# Altium project Traffic_Lignt_CU.PrjPCB
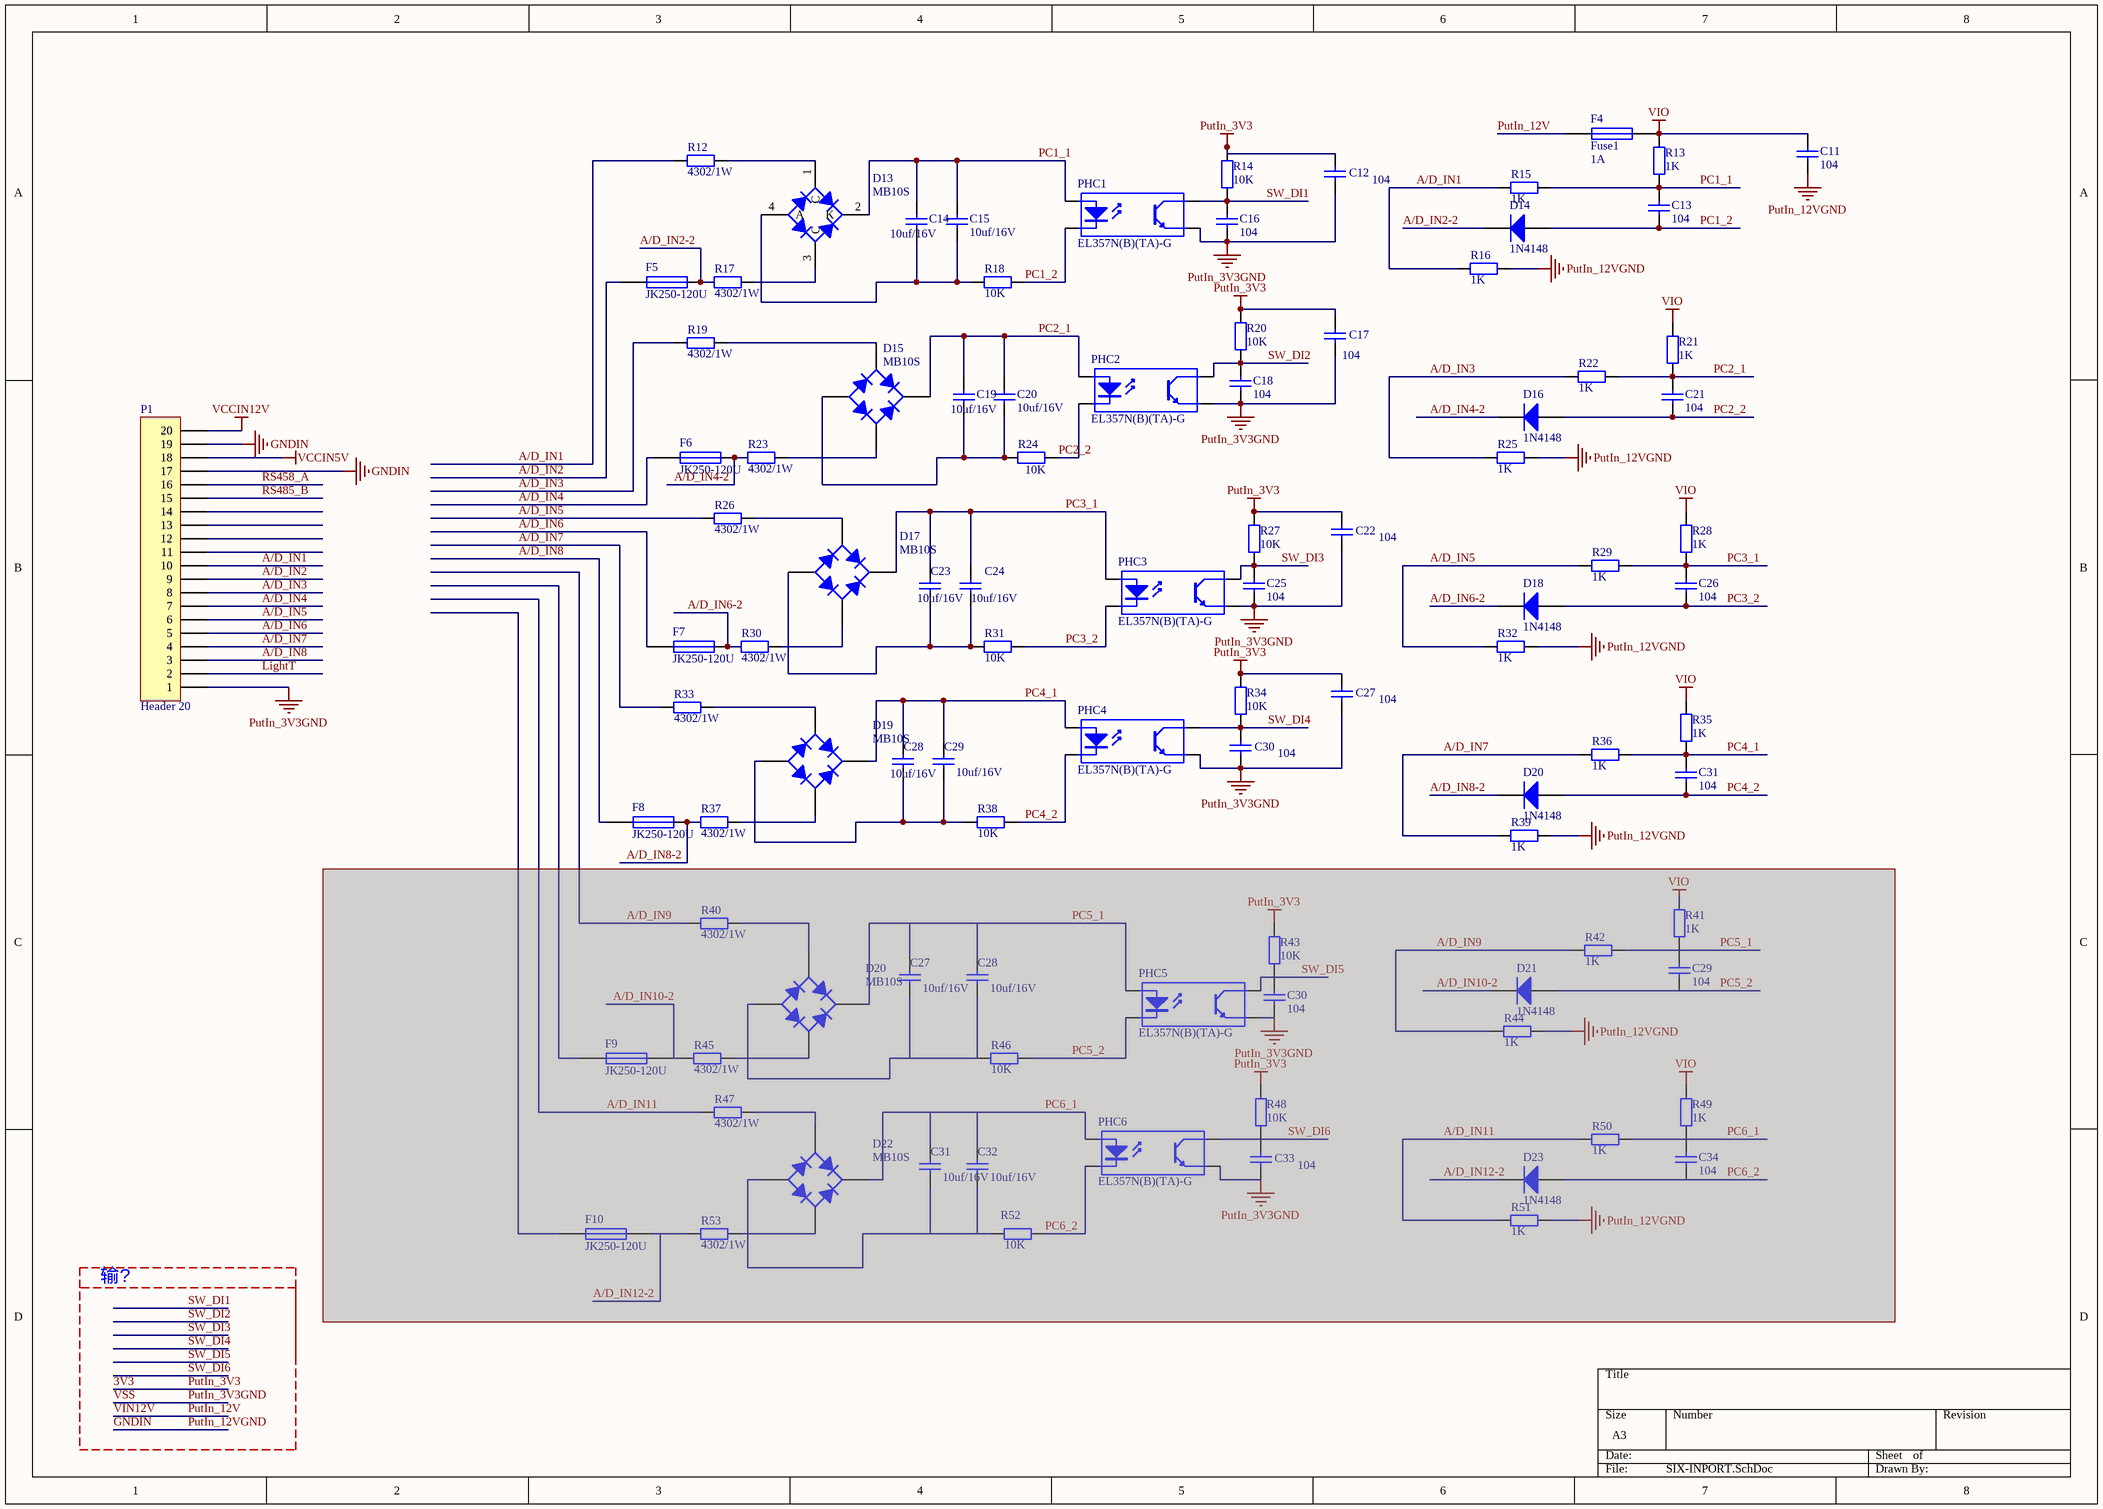
[diagram p0: SIX-INPORT.SchDoc]
5 sheets, 404 parts. Net scope: global (net labels, ports and power ports of the same name join across sheets).
Board file: PCB_LU_V2.4PcbDoc.PcbDoc
Sheets:
  SIX-INPORT.SchDoc
  RS485.SchDoc
  SIX_OUTPORT-V2.SchDoc
  POWER.SchDoc
  STM32F103最小系统板.SchDoc

## Sheet SIX-INPORT.SchDoc
size A3

### Parts
(Parts that share a designator on the sheet are numbered #1, #2 ... from top to bottom, then left to right.)
C11  104  [LC-0805_C]
C12  104  [LC-0603_C]
C13  104  [LC-0805_C]
C14#1  10uf/16V  [LC-0805_C]
C15#1  10uf/16V  [LC-0805_C]
C16  104  [LC-0603_C]
C17  104  [LC-0603_C]
C18#1  104  [LC-0603_C]
C19#1  10uf/16V  [LC-0805_C]
C20  10uf/16V  [LC-0805_C]
C21  104  [LC-0805_C]
C22  104  [LC-0603_C]
C23#1  10uf/16V  [LC-0805_C]
C24  10uf/16V  [LC-0805_C]
C25  104  [LC-0603_C]
C26  104  [LC-0805_C]
C27#1  104  [LC-0603_C]
C27#2  10uf/16V  [LC-0805_C]  (masked out: inside a compile mask, not in the netlist)
C28#1  10uf/16V  [LC-0805_C]
C28#2  10uf/16V  [LC-0805_C]  (masked out: inside a compile mask, not in the netlist)
C29#1  10uf/16V  [LC-0805_C]
C29#2  104  [LC-0805_C]  (masked out: inside a compile mask, not in the netlist)
C30#1  104  [LC-0603_C]
C30#2  104  [LC-0603_C]  (masked out: inside a compile mask, not in the netlist)
C31#1  104  [LC-0805_C]
C31#2  10uf/16V  [LC-0805_C]  (masked out: inside a compile mask, not in the netlist)
C32#1  10uf/16V  [LC-0805_C]  (masked out: inside a compile mask, not in the netlist)
C33#1  104  [LC-0603_C]  (masked out: inside a compile mask, not in the netlist)
C34#1  104  [LC-0805_C]  (masked out: inside a compile mask, not in the netlist)
D13  MB10S  [LC-MBS]
D14  1N4148  [LC-SOD-123]
D15  MB10S  [LC-MBS]
D16#1  1N4148  [LC-SOD-123]
D17  MB10S  [LC-MBS]
D18  1N4148  [LC-SOD-123]
D19  MB10S  [LC-MBS]
D20#1  1N4148  [LC-SOD-123]
D20#2  MB10S  [LC-MBS]  (masked out: inside a compile mask, not in the netlist)
D21#1  1N4148  [LC-SOD-123]  (masked out: inside a compile mask, not in the netlist)
D22#1  MB10S  [LC-MBS]  (masked out: inside a compile mask, not in the netlist)
D23#1  1N4148  [LC-SOD-123]  (masked out: inside a compile mask, not in the netlist)
F4  Fuse1  value 1A  [0805-1]
F5  JK250-120U  [ntc250v]
F6  JK250-120U  [ntc250v]
F7  JK250-120U  [ntc250v]
F8  JK250-120U  [ntc250v]
F9#1  JK250-120U  [ntc250v]  (masked out: inside a compile mask, not in the netlist)
F10  JK250-120U  [ntc250v]  (masked out: inside a compile mask, not in the netlist)
P1  Header 20  [HDR_5.0_20P]
PHC1  EL357N(B)(TA)-G  [LC-SOP-4_P2.54]
PHC2  EL357N(B)(TA)-G  [LC-SOP-4_P2.54]
PHC3  EL357N(B)(TA)-G  [LC-SOP-4_P2.54]
PHC4  EL357N(B)(TA)-G  [LC-SOP-4_P2.54]
PHC5  EL357N(B)(TA)-G  [LC-SOP-4_P2.54]  (masked out: inside a compile mask, not in the netlist)
PHC6  EL357N(B)(TA)-G  [LC-SOP-4_P2.54]  (masked out: inside a compile mask, not in the netlist)
R12  4302/1W  [1812]
R13  value 1K  [0805-1]  (hidden comment: Res1)
R14  10K  [LC-0603_R]
R15#1  value 1K  [0805-1]  (hidden comment: Res1)
R16#1  value 1K  [0805-1]  (hidden comment: Res1)
R17#1  4302/1W  [1812]
R18#1  10K  [LC-0603_R]
R19  4302/1W  [1812]
R20  10K  [LC-0603_R]
R21  value 1K  [0805-1]  (hidden comment: Res1)
R22  value 1K  [0805-1]  (hidden comment: Res1)
R23  4302/1W  [1812]
R24  10K  [LC-0603_R]
R25  value 1K  [0805-1]  (hidden comment: Res1)
R26  4302/1W  [1812]
R27  10K  [LC-0603_R]
R28#1  value 1K  [0805-1]  (hidden comment: Res1)
R29  value 1K  [0805-1]  (hidden comment: Res1)
R30  4302/1W  [1812]
R31  10K  [LC-0603_R]
R32  value 1K  [0805-1]  (hidden comment: Res1)
R33  4302/1W  [1812]
R34  10K  [LC-0603_R]
R35  value 1K  [0805-1]  (hidden comment: Res1)
R36  value 1K  [0805-1]  (hidden comment: Res1)
R37  4302/1W  [1812]
R38  10K  [LC-0603_R]
R39  value 1K  [0805-1]  (hidden comment: Res1)
R40#1  4302/1W  [1812]  (masked out: inside a compile mask, not in the netlist)
R41#1  value 1K  [0805-1]  (hidden comment: Res1)  (masked out: inside a compile mask, not in the netlist)
R42#1  value 1K  [0805-1]  (hidden comment: Res1)  (masked out: inside a compile mask, not in the netlist)
R43#1  10K  [LC-0603_R]  (masked out: inside a compile mask, not in the netlist)
R44#1  value 1K  [0805-1]  (hidden comment: Res1)  (masked out: inside a compile mask, not in the netlist)
R45#1  4302/1W  [1812]  (masked out: inside a compile mask, not in the netlist)
R46#1  10K  [LC-0603_R]  (masked out: inside a compile mask, not in the netlist)
R47#1  4302/1W  [1812]  (masked out: inside a compile mask, not in the netlist)
R48#1  10K  [LC-0603_R]  (masked out: inside a compile mask, not in the netlist)
R49#1  value 1K  [0805-1]  (hidden comment: Res1)  (masked out: inside a compile mask, not in the netlist)
R50#1  value 1K  [0805-1]  (hidden comment: Res1)  (masked out: inside a compile mask, not in the netlist)
R51#1  value 1K  [0805-1]  (hidden comment: Res1)  (masked out: inside a compile mask, not in the netlist)
R52#1  10K  [LC-0603_R]  (masked out: inside a compile mask, not in the netlist)
R53#1  4302/1W  [1812]  (masked out: inside a compile mask, not in the netlist)

### Nets
3V3: C12.1 C17.1 C22.1 C27#1.1 R14.2 R20.2 R27.2 R34.2  [also labelled PutIn_3V3]
GNDIN: C11.1 C12.2 C16.2 C17.2 C18#1.2 C22.2 C25.2 C27#1.2 C30#1.2 P1.1 P1.17 P1.19 PHC1.3(E) PHC2.3(E) PHC3.3(E) PHC4.3(E) R16#1.1 R25.1 R32.1 R39.1  [also labelled PutIn_12VGND, PutIn_3V3GND, VSS]
PutIn_12V: F4.1  [also labelled VIN12V]
VCCIN5V: P1.18
VCCIN12V: P1.20
VIO: C11.2 F4.2 R13.2 R21.1 R28#1.1 R35.1
A/D_IN1: P1.10 R12.1 R15#1.2 R16#1.2
A/D_IN2: F5.1 P1.9
A/D_IN2-2: D14.2(K) F5.2 R17#1.1
A/D_IN3: P1.8 R19.1 R22.2 R25.2
A/D_IN4: F6.1 P1.7
A/D_IN4-2: D16#1.2(K) F6.2 R23.1
A/D_IN5: P1.6 R26.1 R29.2 R32.2
A/D_IN6: F7.1 P1.5
A/D_IN6-2: D18.2(K) F7.2 R30.1
A/D_IN7: P1.4 R33.1 R36.2 R39.2
A/D_IN8: F8.1 P1.3
A/D_IN8-2: D20#1.2(K) F8.2 R37.1
LightT: P1.2
PC1_1: C13.1 C14#1.2 C15#1.2 D13.2(K) PHC1.1(A) R13.1 R15#1.1
PC1_2: C13.2 D14.1(A) PHC1.2(K) R18#1.1
PC2_1: C19#1.2 C20.2 C21.1 D15.2(K) PHC2.1(A) R21.2 R22.1
PC2_2: C21.2 D16#1.1(A) PHC2.2(K) R24.1
PC3_1: C23#1.2 C24.2 C26.1 D17.2(K) PHC3.1(A) R28#1.2 R29.1
PC3_2: C26.2 D18.1(A) PHC3.2(K) R31.1
PC4_1: C28#1.2 C29#1.2 C31#1.1 D19.2(K) PHC4.1(A) R35.2 R36.1
PC4_2: C31#1.2 D20#1.1(A) PHC4.2(K) R38.1
RS458_A: P1.16
RS485_B: P1.15
SW_DI1: C16.1 PHC1.4(C) R14.1
SW_DI2: C18#1.1 PHC2.4(C) R20.1
SW_DI3: C25.1 PHC3.4(C) R27.1
SW_DI4: C30#1.1 PHC4.4(C) R34.1
NetC14#1_1: C14#1.1 C15#1.1 D13.4(A) R18#1.2
NetC19#1_1: C19#1.1 C20.1 D15.4(A) R24.2
NetC23#1_1: C23#1.1 C24.1 D17.4(A) R31.2
NetC28#1_1: C28#1.1 C29#1.1 D19.4(A) R38.2
NetD13_1: D13.1(C) R12.2
NetD13_3: D13.3(C) R17#1.2
NetD15_1: D15.1(C) R19.2
NetD15_3: D15.3(C) R23.2
NetD17_1: D17.1(C) R26.2
NetD17_3: D17.3(C) R30.2
NetD19_1: D19.1(C) R33.2
NetD19_3: D19.3(C) R37.2

Not connected (* = marked no-connect by the designer): P1 11 12 13 14

### Notes on the sheet
- 输?

### Library data of the parts
C11 C12 C14#1 C15#1 C16 C17 C18#1 C19#1 C20 C22 C23#1 C24 C25 C27#1 C27#2 C28#1 C28#2 C29#1 C30#1 C30#2 C31#2 C32#1 C33#1 = Cap: Capacitor; Value: 100pF; Published: 8-Jun-2000; LatestRevisionDate: 17-Jul-2002; LatestRevisionNote: Re-released for DXP Platform.; PackageReference: RAD-0.3; Publisher: Altium Limited; PackageDescription: Radial Cap, Thru-Hole; 2 Leads; 0.3 in Pin Spacing
C13 C21 C26 C29#2 C31#1 C34#1 = Cap: Capacitor; Value: 100nF; Published: 8-Jun-2000; Revision: July-2002: Re-released for DXP Platform.; Publisher: Altium Limited
D13 D15 D17 D19 D20#2 D22#1 = MBS: 整流桥; ComponentLink1Description: 供应商链接; ComponentLink1URL: http://www.szlcsc.com/product/details_2865.html; Package: MBS; Supplier: LC; SuppliersPartNumber: C2488
D14 D16#1 D18 D20#1 D21#1 D23#1 = Diode: Default Diode; Published: 8-Jun-2000; LatestRevisionDate: 17-Jul-2002; LatestRevisionNote: Re-released for DXP Platform.; PackageDocument: Sep-1996; PackageReference: SMC; Publisher: Altium Limited; Code_JEDEC: DO-214-AB
F4 = F: 保险丝
F5-F8 F9#1 F10 = Fuse1: 保险丝; Value: 1A
P1 = Header 20: Header, 20-Pin; LatestRevisionDate: 17-Jul-2002; LatestRevisionNote: Re-released for DXP Platform.; Publisher: Altium Limited
PHC1-PHC6 = EL357N: 贴片光耦; ComponentLink1Description: 供应商链接; ComponentLink1URL: http://www.szlcsc.com/product/details_7114.html; Package: SOP-4_P2.54; Supplier: LC; SuppliersPartNumber: C6649
R12 R14 R17#1 R18#1 R19 R20 R23 R24 R26 R27 R30 R31 R33 R34 R37 R38 R40#1 R43#1 R45#1 R46#1 R47#1 R48#1 R52#1 R53#1 = Res2: Resistor; Value: 1K; Published: 8-Jun-2000; LatestRevisionDate: 17-Jul-2002; LatestRevisionNote: Re-released for DXP Platform.; PackageReference: AXIAL-0.4; Publisher: Altium Limited; PackageDescription: Axial Device, Thru-Hole; 2 Leads; 0.4 in Pin Spacing
R13 R15#1 R16#1 R21 R22 R25 R28#1 R29 R32 R35 R36 R39 R41#1 R42#1 R44#1 R49#1 R50#1 R51#1 = R: 贴片电阻; Published: 8-Jun-2000; LatestRevisionDate: 17-Jul-2002; LatestRevisionNote: Re-released for DXP Platform.; PackageReference: AXIAL-0.4; Publisher: Altium Limited

## Sheet RS485.SchDoc
size A4
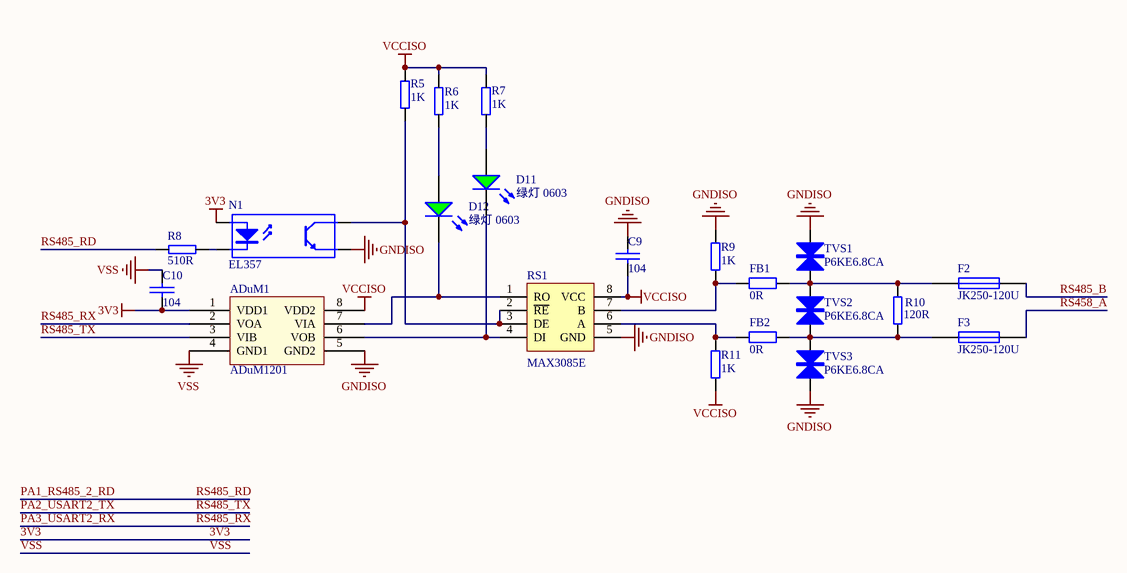
[diagram p1: RS485.SchDoc]

### Parts
(Parts that share a designator on the sheet are numbered #1, #2 ... from top to bottom, then left to right.)
ADuM1  ADuM1201  [SOIC-8]
C9  104  [LC-0603_C]
C10  104  [LC-0603_C]
D11  绿灯 0603  [0603_LED_G]
D12  绿灯 0603  [0603_LED_G]
F2#1  JK250-120U  [ntc250v]
F3  JK250-120U  [ntc250v]
FB1  0R  [LC-0603_L]
FB2  0R  [LC-0603_L]
N1  EL357  [lc-sop-4_P2.54]
R5#1  1K  [LC-0603_R]
R6#1  1K  [LC-0603_R]
R7  1K  [LC-0603_R]
R8  510R  [LC-0603_R]
R9  1K  [LC-0603_R]
R10  120R  [LC-0603_R]
R11  1K  [LC-0603_R]
RS1  MAX3085E  [SOIC-8]
TVS1  P6KE6.8CA  [TVS]
TVS2  P6KE6.8CA  [TVS]
TVS3  P6KE6.8CA  [TVS]

### Nets
3V3: ADuM1.1(VDD1) C10.2 N1.1(A)
GNDISO: ADuM1.5(GND2) C9.1 N1.3(E) R9.1 RS1.5(GND) TVS1.2 TVS3.1
VCCISO: ADuM1.8(VDD2) C9.2 R5#1.1 R6#1.2 R7.1 R11.2 RS1.8(VCC)
VSS: ADuM1.4(GND1) C10.1  [project net GNDIN]
PA1_RS485_2_RD: R8.1  [also labelled RS485_RD]
PA2_USART2_TX: ADuM1.3(VIB)  [also labelled RS485_TX]
PA3_USART2_RX: ADuM1.2(VOA)  [also labelled RS485_RX]
RS458_A: F3.2
RS485_B: F2#1.2
NetADuM1_6: ADuM1.6(VOB) D11.K RS1.4(DI)
NetADuM1_7: ADuM1.7(VIA) D12.K RS1.1(RO)
NetD11_A: D11.A R7.2
NetD12_A: D12.A R6#1.1
NetF2#1_1: F2#1.1 FB1.1 R10.2 TVS1.1 TVS2.2
NetF3_1: F3.1 FB2.1 R10.1 TVS2.1 TVS3.2
NetFB1_2: FB1.2 R9.2 RS1.7(B)
NetFB2_2: FB2.2 R11.1 RS1.6(A)
NetN1_2: N1.2(K) R8.2
NetN1_4: N1.4(C) R5#1.2 RS1.2(~{RE}) RS1.3(DE)

### Library data of the parts
C9 C10 = CAP
D11 D12 = 0: 发光二极管; ComponentLink1Descrip: 供应商链接; ComponentLink1URL: http://www.szlcsc.com/product/details_73152.html; Package: 0603; Supplier: LC; SuppliersPartNumber: C72043
F2#1 F3 = F: 保险丝; Value: 1A
FB1 FB2 = Res2: Resistor; Published: 8-Jun-2000; LatestRevisionDate: 17-Jul-2002; LatestRevisionNote: Re-released for DXP Platform.; PackageReference: AXIAL-0.4; Publisher: Altium Limited; Value: 0R
N1 = ST188: 反射式光电传感器; Published: 24-Mar-1999; LatestRevisionDate: 04-Mar-2005; LatestRevisionNote: Sch pins 3 & 4 Swapped.; DatasheetDocument: Nov-2003; PackageReference: DIP-4; Publisher: Altium Limited
R5#1 R6#1 R7 R8 = RES2
R9-R11 = RES
TVS1-TVS3 = TVS

## Sheet SIX_OUTPORT-V2.SchDoc
size A2
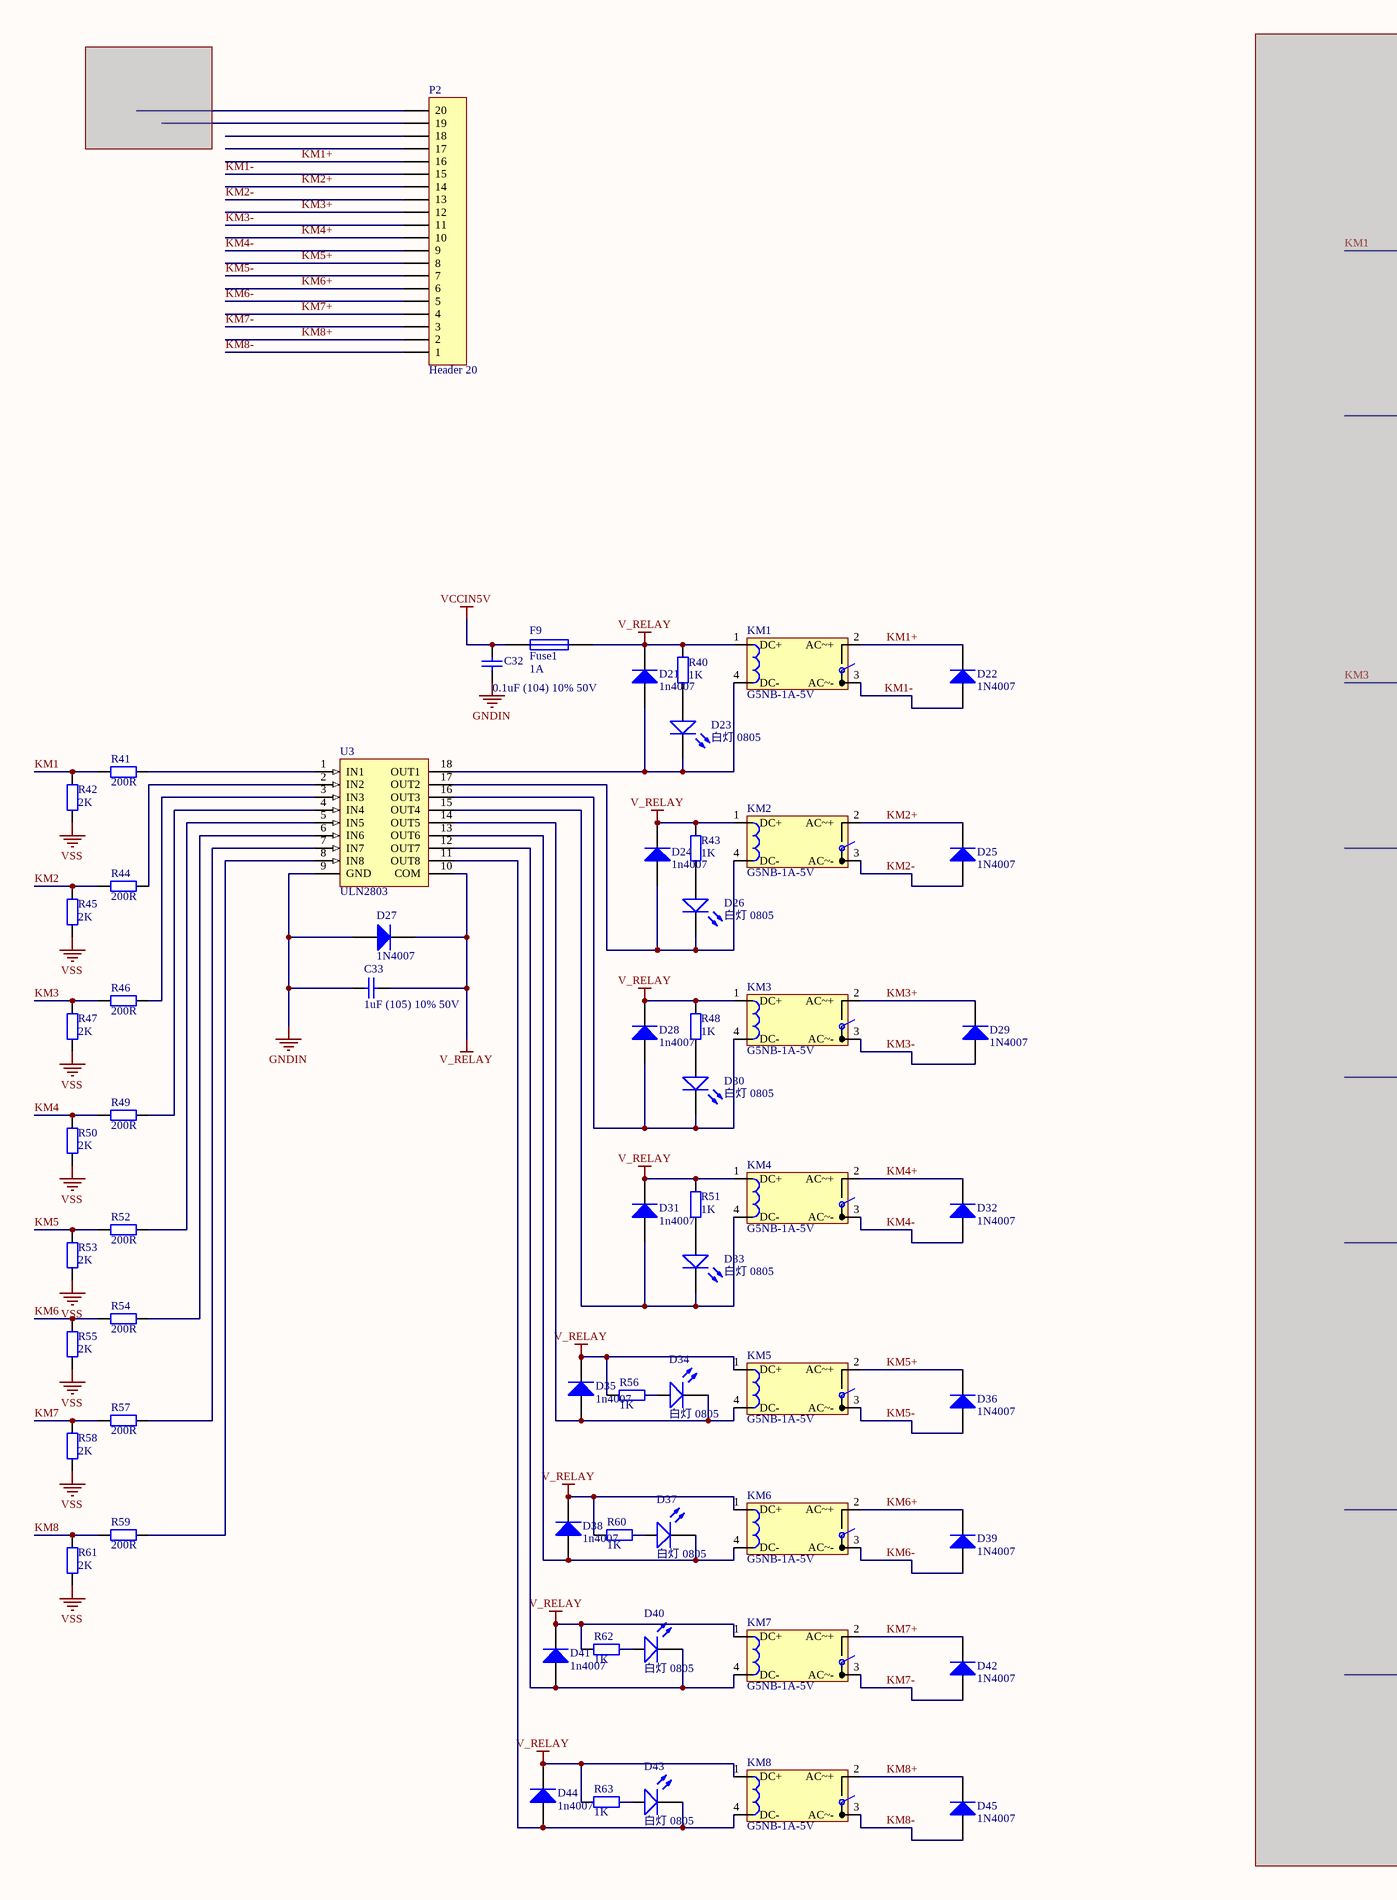
[diagram p2: SIX_OUTPORT-V2.SchDoc, left]
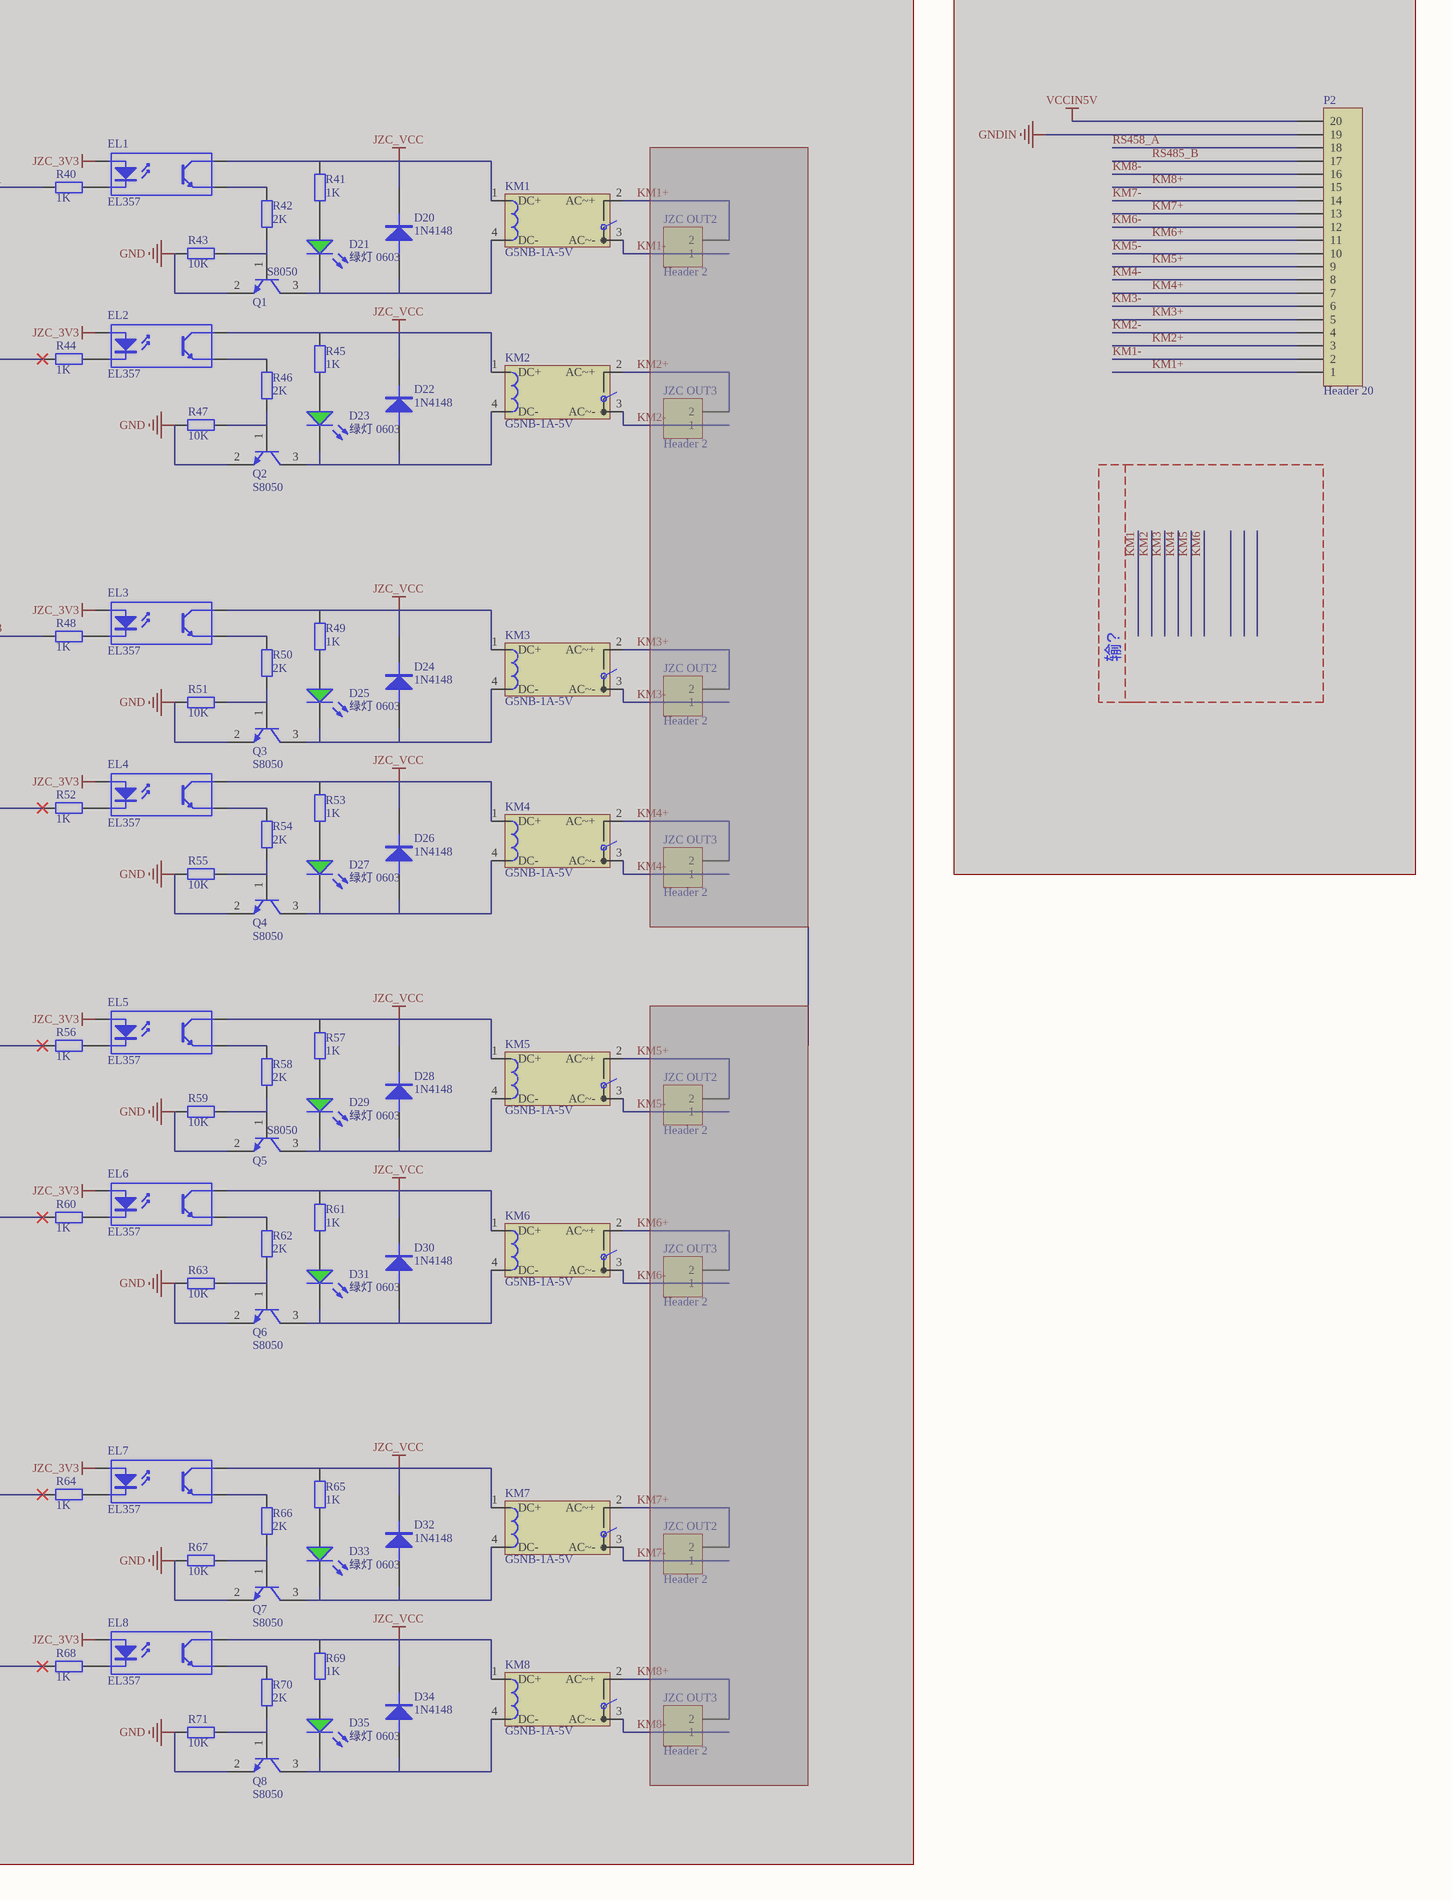
[diagram p3: SIX_OUTPORT-V2.SchDoc, right]

### Parts
(Parts that share a designator on the sheet are numbered #1, #2 ... from top to bottom, then left to right.)
C32#2  0.1uF (104) 10% 50V  [LC-1206_C]
C33#2  1uF (105) 10% 50V  [LC-0805_C]
D20#3  1N4148  [LC-SOD-123]  (masked out: inside a compile mask, not in the netlist)
D21#2  绿灯 0603  [LC-0603_LED_S1]  (masked out: inside a compile mask, not in the netlist)
D21#3  1n4007  [LC-SOD-123]
D22#2  1N4148  [LC-SOD-123]  (masked out: inside a compile mask, not in the netlist)
D22#3  1N4007  [LC-SOD-123]
D23#2  绿灯 0603  [LC-0603_LED_S1]  (masked out: inside a compile mask, not in the netlist)
D23#3  白灯 0805  [LC-0603_LED_S1]
D24#1  1N4148  [LC-SOD-123]  (masked out: inside a compile mask, not in the netlist)
D24#2  1n4007  [LC-SOD-123]
D25#1  绿灯 0603  [LC-0603_LED_S1]  (masked out: inside a compile mask, not in the netlist)
D25#2  1N4007  [LC-SOD-123]
D26#1  白灯 0805  [LC-0603_LED_S1]
D26#2  1N4148  [LC-SOD-123]  (masked out: inside a compile mask, not in the netlist)
D27#1  绿灯 0603  [LC-0603_LED_S1]  (masked out: inside a compile mask, not in the netlist)
D27#2  1N4007  [LC-SOD-123]
D28#1  1n4007  [LC-SOD-123]
D28#2  1N4148  [LC-SOD-123]  (masked out: inside a compile mask, not in the netlist)
D29#1  1N4007  [LC-SOD-123]
D29#2  绿灯 0603  [LC-0603_LED_S1]  (masked out: inside a compile mask, not in the netlist)
D30#1  白灯 0805  [LC-0603_LED_S1]
D30#2  1N4148  [LC-SOD-123]  (masked out: inside a compile mask, not in the netlist)
D31#1  1n4007  [LC-SOD-123]
D31#2  绿灯 0603  [LC-0603_LED_S1]  (masked out: inside a compile mask, not in the netlist)
D32#1  1N4007  [LC-SOD-123]
D32#2  1N4148  [LC-SOD-123]  (masked out: inside a compile mask, not in the netlist)
D33#1  白灯 0805  [LC-0603_LED_S1]
D33#2  绿灯 0603  [LC-0603_LED_S1]  (masked out: inside a compile mask, not in the netlist)
D34#1  白灯 0805  [LC-0603_LED_S1]
D34#2  1N4148  [LC-SOD-123]  (masked out: inside a compile mask, not in the netlist)
D35#1  1n4007  [LC-SOD-123]
D35#2  绿灯 0603  [LC-0603_LED_S1]  (masked out: inside a compile mask, not in the netlist)
D36  1N4007  [LC-SOD-123]
D37  白灯 0805  [LC-0603_LED_S1]
D38  1n4007  [LC-SOD-123]
D39  1N4007  [LC-SOD-123]
D40#1  白灯 0805  [LC-0603_LED_S1]
D41#1  1n4007  [LC-SOD-123]
D42#1  1N4007  [LC-SOD-123]
D43#1  白灯 0805  [LC-0603_LED_S1]
D44  1n4007  [LC-SOD-123]
D45  1N4007  [LC-SOD-123]
EL1  EL357  [lc-sop-4_P2.54]  (masked out: inside a compile mask, not in the netlist)
EL2  EL357  [lc-sop-4_P2.54]  (masked out: inside a compile mask, not in the netlist)
EL3  EL357  [lc-sop-4_P2.54]  (masked out: inside a compile mask, not in the netlist)
EL4  EL357  [lc-sop-4_P2.54]  (masked out: inside a compile mask, not in the netlist)
EL5  EL357  [lc-sop-4_P2.54]  (masked out: inside a compile mask, not in the netlist)
EL6  EL357  [lc-sop-4_P2.54]  (masked out: inside a compile mask, not in the netlist)
EL7  EL357  [lc-sop-4_P2.54]  (masked out: inside a compile mask, not in the netlist)
EL8  EL357  [lc-sop-4_P2.54]  (masked out: inside a compile mask, not in the netlist)
F9#2  Fuse1  value 1A  [LC-1206_R]
JZC_OUT2#1  Header 2  [D5.08-2P]  (masked out: inside a compile mask, not in the netlist)
JZC_OUT2#2  Header 2  [D5.08-2P]  (masked out: inside a compile mask, not in the netlist)
JZC_OUT2#3  Header 2  [D5.08-2P]  (masked out: inside a compile mask, not in the netlist)
JZC_OUT2#4  Header 2  [D5.08-2P]  (masked out: inside a compile mask, not in the netlist)
JZC_OUT3#1  Header 2  [D5.08-2P]  (masked out: inside a compile mask, not in the netlist)
JZC_OUT3#2  Header 2  [D5.08-2P]  (masked out: inside a compile mask, not in the netlist)
JZC_OUT3#3  Header 2  [D5.08-2P]  (masked out: inside a compile mask, not in the netlist)
JZC_OUT3#4  Header 2  [D5.08-2P]  (masked out: inside a compile mask, not in the netlist)
KM1#1  G5NB-1A-5V  [G5NB-1A-5V]  (masked out: inside a compile mask, not in the netlist)
KM1#2  G5NB-1A-5V  [G5NB-1A-5V]
KM2#1  G5NB-1A-5V  [G5NB-1A-5V]  (masked out: inside a compile mask, not in the netlist)
KM2#2  G5NB-1A-5V  [G5NB-1A-5V]
KM3#1  G5NB-1A-5V  [G5NB-1A-5V]  (masked out: inside a compile mask, not in the netlist)
KM3#2  G5NB-1A-5V  [G5NB-1A-5V]
KM4#1  G5NB-1A-5V  [G5NB-1A-5V]  (masked out: inside a compile mask, not in the netlist)
KM4#2  G5NB-1A-5V  [G5NB-1A-5V]
KM5#1  G5NB-1A-5V  [G5NB-1A-5V]  (masked out: inside a compile mask, not in the netlist)
KM5#2  G5NB-1A-5V  [G5NB-1A-5V]
KM6#1  G5NB-1A-5V  [G5NB-1A-5V]  (masked out: inside a compile mask, not in the netlist)
KM6#2  G5NB-1A-5V  [G5NB-1A-5V]
KM7#1  G5NB-1A-5V  [G5NB-1A-5V]  (masked out: inside a compile mask, not in the netlist)
KM7#2  G5NB-1A-5V  [G5NB-1A-5V]
KM8#1  G5NB-1A-5V  [G5NB-1A-5V]  (masked out: inside a compile mask, not in the netlist)
KM8#2  G5NB-1A-5V  [G5NB-1A-5V]
P2#1  Header 20  [HDR_5.0_20P]
P2#2  Header 20  [HDR_5.0_20P]  (masked out: inside a compile mask, not in the netlist)
Q1#1  S8050  [LC-SOT-23(SOT-23-3)]  (masked out: inside a compile mask, not in the netlist)
Q2  S8050  [LC-SOT-23(SOT-23-3)]  (masked out: inside a compile mask, not in the netlist)
Q3  S8050  [LC-SOT-23(SOT-23-3)]  (masked out: inside a compile mask, not in the netlist)
Q4  S8050  [LC-SOT-23(SOT-23-3)]  (masked out: inside a compile mask, not in the netlist)
Q5  S8050  [LC-SOT-23(SOT-23-3)]  (masked out: inside a compile mask, not in the netlist)
Q6#1  S8050  [LC-SOT-23(SOT-23-3)]  (masked out: inside a compile mask, not in the netlist)
Q7#1  S8050  [LC-SOT-23(SOT-23-3)]  (masked out: inside a compile mask, not in the netlist)
Q8  S8050  [LC-SOT-23(SOT-23-3)]  (masked out: inside a compile mask, not in the netlist)
R40#2  1K  [LC-0603_R]  (masked out: inside a compile mask, not in the netlist)
R40#3  1K  [LC-0603_R]
R41#2  1K  [LC-0603_R]  (masked out: inside a compile mask, not in the netlist)
R41#3  200R  [LC-0603_R]
R42#2  2K  [LC-0603_R]  (masked out: inside a compile mask, not in the netlist)
R42#3  2K  [LC-0603_R]
R43#2  10K  [LC-0603_R]  (masked out: inside a compile mask, not in the netlist)
R43#3  1K  [LC-0603_R]
R44#2  1K  [LC-0603_R]  (masked out: inside a compile mask, not in the netlist)
R44#3  200R  [LC-0603_R]
R45#2  1K  [LC-0603_R]  (masked out: inside a compile mask, not in the netlist)
R45#3  2K  [LC-0603_R]
R46#2  2K  [LC-0603_R]  (masked out: inside a compile mask, not in the netlist)
R46#3  200R  [LC-0603_R]
R47#2  10K  [LC-0603_R]  (masked out: inside a compile mask, not in the netlist)
R47#3  2K  [LC-0603_R]
R48#2  1K  [LC-0603_R]  (masked out: inside a compile mask, not in the netlist)
R48#3  1K  [LC-0603_R]
R49#2  1K  [LC-0603_R]  (masked out: inside a compile mask, not in the netlist)
R49#3  200R  [LC-0603_R]
R50#2  2K  [LC-0603_R]  (masked out: inside a compile mask, not in the netlist)
R50#3  2K  [LC-0603_R]
R51#2  10K  [LC-0603_R]  (masked out: inside a compile mask, not in the netlist)
R51#3  1K  [LC-0603_R]
R52#2  1K  [LC-0603_R]  (masked out: inside a compile mask, not in the netlist)
R52#3  200R  [LC-0603_R]
R53#2  1K  [LC-0603_R]  (masked out: inside a compile mask, not in the netlist)
R53#3  2K  [LC-0603_R]
R54#1  2K  [LC-0603_R]  (masked out: inside a compile mask, not in the netlist)
R54#2  200R  [LC-0603_R]
R55#1  10K  [LC-0603_R]  (masked out: inside a compile mask, not in the netlist)
R55#2  2K  [LC-0603_R]
R56#1  1K  [LC-0603_R]  (masked out: inside a compile mask, not in the netlist)
R56#2  1K  [LC-0603_R]
R57#1  1K  [LC-0603_R]  (masked out: inside a compile mask, not in the netlist)
R57#2  200R  [LC-0603_R]
R58#1  2K  [LC-0603_R]  (masked out: inside a compile mask, not in the netlist)
R58#2  2K  [LC-0603_R]
R59#1  10K  [LC-0603_R]  (masked out: inside a compile mask, not in the netlist)
R59#2  200R  [LC-0603_R]
R60#1  1K  [LC-0603_R]  (masked out: inside a compile mask, not in the netlist)
R60#2  1K  [LC-0603_R]
R61#1  1K  [LC-0603_R]  (masked out: inside a compile mask, not in the netlist)
R61#2  2K  [LC-0603_R]
R62#1  2K  [LC-0603_R]  (masked out: inside a compile mask, not in the netlist)
R62#2  1K  [LC-0603_R]
R63#1  10K  [LC-0603_R]  (masked out: inside a compile mask, not in the netlist)
R63#2  1K  [LC-0603_R]
R64#1  1K  [LC-0603_R]  (masked out: inside a compile mask, not in the netlist)
R65#1  1K  [LC-0603_R]  (masked out: inside a compile mask, not in the netlist)
R66#1  2K  [LC-0603_R]  (masked out: inside a compile mask, not in the netlist)
R67#1  10K  [LC-0603_R]  (masked out: inside a compile mask, not in the netlist)
R68#1  1K  [LC-0603_R]  (masked out: inside a compile mask, not in the netlist)
R69#1  1K  [LC-0603_R]  (masked out: inside a compile mask, not in the netlist)
R70#1  2K  [LC-0603_R]  (masked out: inside a compile mask, not in the netlist)
R71#1  10K  [LC-0603_R]  (masked out: inside a compile mask, not in the netlist)
U3  ULN2803  [LC-SOIC-18_300mil]

### Nets
GNDIN: C32#2.1 C33#2.1 D27#2.1(A) R42#3.2 R45#3.2 R47#3.2 R50#3.2 R53#3.2 R55#2.2 R58#2.2 R61#2.2 U3.9(GND)  [also labelled VSS]
V_RELAY: C33#2.2 D21#3.2(K) D24#2.2(K) D27#2.2(K) D28#1.2(K) D31#1.2(K) D35#1.2(K) D38.2(K) D41#1.2(K) D44.2(K) F9#2.2 KM1#2.1(DC+) KM2#2.1(DC+) KM3#2.1(DC+) KM4#2.1(DC+) KM5#2.1(DC+) KM6#2.1(DC+) KM7#2.1(DC+) KM8#2.1(DC+) R40#3.1 R43#3.1 R48#3.1 R51#3.1 R56#2.1 R60#2.1 R62#2.1 R63#2.1 U3.10(COM)
VCCIN5V: C32#2.2 F9#2.1
KM1: R41#3.2 R42#3.1
KM1+: D22#3.2(K) KM1#2.2(AC~+) P2#1.16
KM1-: D22#3.1(A) KM1#2.3(AC~-) P2#1.15
KM2: R44#3.2 R45#3.1
KM2+: D25#2.2(K) KM2#2.2(AC~+) P2#1.14
KM2-: D25#2.1(A) KM2#2.3(AC~-) P2#1.13
KM3: R46#3.2 R47#3.1
KM3+: D29#1.2(K) KM3#2.2(AC~+) P2#1.12
KM3-: D29#1.1(A) KM3#2.3(AC~-) P2#1.11
KM4: R49#3.2 R50#3.1
KM4+: D32#1.2(K) KM4#2.2(AC~+) P2#1.10
KM4-: D32#1.1(A) KM4#2.3(AC~-) P2#1.9
KM5: R52#3.2 R53#3.1
KM5+: D36.2(K) KM5#2.2(AC~+) P2#1.8
KM5-: D36.1(A) KM5#2.3(AC~-) P2#1.7
KM6: R54#2.2 R55#2.1
KM6+: D39.2(K) KM6#2.2(AC~+) P2#1.6
KM6-: D39.1(A) KM6#2.3(AC~-) P2#1.5
KM7: R57#2.2 R58#2.1
KM7+: D42#1.2(K) KM7#2.2(AC~+) P2#1.4
KM7-: D42#1.1(A) KM7#2.3(AC~-) P2#1.3
KM8: R59#2.2 R61#2.1
KM8+: D45.2(K) KM8#2.2(AC~+) P2#1.2
KM8-: D45.1(A) KM8#2.3(AC~-) P2#1.1
NetD21#3_1: D21#3.1(A) D23#3.K KM1#2.4(DC-) U3.18(OUT1)
NetD23#3_A: D23#3.A R40#3.2
NetD24#2_1: D24#2.1(A) D26#1.K KM2#2.4(DC-) U3.17(OUT2)
NetD26#1_A: D26#1.A R43#3.2
NetD28#1_1: D28#1.1(A) D30#1.K KM3#2.4(DC-) U3.16(OUT3)
NetD30#1_A: D30#1.A R48#3.2
NetD31#1_1: D31#1.1(A) D33#1.K KM4#2.4(DC-) U3.15(OUT4)
NetD33#1_A: D33#1.A R51#3.2
NetD34#1_A: D34#1.A R56#2.2
NetD34#1_K: D34#1.K D35#1.1(A) KM5#2.4(DC-) U3.14(OUT5)
NetD37_A: D37.A R60#2.2
NetD37_K: D37.K D38.1(A) KM6#2.4(DC-) U3.13(OUT6)
NetD40#1_A: D40#1.A R62#2.2
NetD40#1_K: D40#1.K D41#1.1(A) KM7#2.4(DC-) U3.12(OUT7)
NetD43#1_A: D43#1.A R63#2.2
NetD43#1_K: D43#1.K D44.1(A) KM8#2.4(DC-) U3.11(OUT8)
NetR41#3_1: R41#3.1 U3.1(IN1)
NetR44#3_1: R44#3.1 U3.2(IN2)
NetR46#3_1: R46#3.1 U3.3(IN3)
NetR49#3_1: R49#3.1 U3.4(IN4)
NetR52#3_1: R52#3.1 U3.5(IN5)
NetR54#2_1: R54#2.1 U3.6(IN6)
NetR57#2_1: R57#2.1 U3.7(IN7)
NetR59#2_1: R59#2.1 U3.8(IN8)

Not connected (* = marked no-connect by the designer): P2#1 17 18 19 20

### Notes on the sheet
- 输?

### Library data of the parts
C32#2 C33#2 = 0805 1uF (105) 10% 50V: 贴片电容; ComponentLink1Description: 供应商链接; ComponentLink1URL: http://www.szlcsc.com/product/details_29074.html; Package: 0805; Supplier: LC; SuppliersPartNumber: C28323
D20#3 D22#2 D24#1 D26#2 D28#2 D30#2 D32#2 D34#2 = DIODE
D21#2 D23#2 D25#1 D27#1 D29#2 D31#2 D33#2 D35#2 = 0603 绿灯: 发光二极管; ComponentLink1Description: 供应商链接; ComponentLink1URL: http://www.szlcsc.com/product/details_73152.html; Package: 0603; Supplier: LC; SuppliersPartNumber: C72043
D21#3 D22#3 D24#2 D25#2 D27#2 D28#1 D29#1 D31#1 D32#1 D35#1 D36 D38 D39 D41#1 D42#1 D44 D45 = Diode: Default Diode; Published: 8-Jun-2000; LatestRevisionDate: 17-Jul-2002; LatestRevisionNote: Re-released for DXP Platform.; PackageDocument: Sep-1996; PackageReference: SMC; Publisher: Altium Limited; Code_JEDEC: DO-214-AB
D23#3 D26#1 D30#1 D33#1 D34#1 D37 D40#1 D43#1 = 0805 白灯: 发光二极管; ComponentLink1Description: 供应商链接; ComponentLink1URL: http://www.szlcsc.com/product/details_35468.html; Package: 0805; Supplier: LC; SuppliersPartNumber: C34499
EL1-EL8 = ST188: 反射式光电传感器; Published: 24-Mar-1999; LatestRevisionDate: 04-Mar-2005; LatestRevisionNote: Sch pins 3 & 4 Swapped.; DatasheetDocument: Nov-2003; PackageReference: DIP-4; Publisher: Altium Limited
F9#2 = Fuse1: 保险丝
JZC_OUT2#1-JZC_OUT2#4 JZC_OUT3#1-JZC_OUT3#4 = Header 2: Header, 2-Pin; LatestRevisionDate: 17-Jul-2002; LatestRevisionNote: Re-released for DXP Platform.; Publisher: Altium Limited
P2#1 P2#2 = Header 20: Header, 20-Pin; LatestRevisionDate: 17-Jul-2002; LatestRevisionNote: Re-released for DXP Platform.; Publisher: Altium Limited
R40#2 R40#3 R41#2 R42#2 R43#2 R43#3 R44#2 R45#2 R46#2 R47#2 R48#2 R48#3 R49#2 R50#2 R51#2 R51#3 R52#2 R53#2 R54#1 R55#1 R56#1 R56#2 R57#1 R58#1 R59#1 R60#1 R60#2 R61#1 R62#1 R62#2 R63#1 R63#2 R64#1 R65#1 R66#1 R67#1 R68#1 R69#1 R70#1 R71#1 = Res2: Resistor; Published: 8-Jun-2000; LatestRevisionDate: 17-Jul-2002; LatestRevisionNote: Re-released for DXP Platform.; PackageReference: AXIAL-0.4; Publisher: Altium Limited
  R40#2 R40#3 R41#2 R43#3 R44#2 R45#2 R48#2 R48#3 R49#2 R51#3 R52#2 R53#2 R56#1 R56#2 R57#1 R60#1 R60#2 R61#1 R62#2 R63#2 R64#1 R65#1 R68#1 R69#1: Value: 1K
  R42#2 R46#2 R50#2 R54#1 R58#1 R62#1 R66#1 R70#1: Value: 2K
  R43#2 R47#2 R51#2 R55#1 R59#1 R63#1 R67#1 R71#1: Value: 10K
R41#3 R42#3 R44#3 R45#3 R46#3 R47#3 R49#3 R50#3 R52#3 R53#3 R54#2 R55#2 R57#2 R58#2 R59#2 R61#2 = Res2: Resistor; Value: 1K; Published: 8-Jun-2000; LatestRevisionDate: 17-Jul-2002; LatestRevisionNote: Re-released for DXP Platform.; PackageReference: AXIAL-0.4; Publisher: Altium Limited

## Sheet POWER.SchDoc
size A4
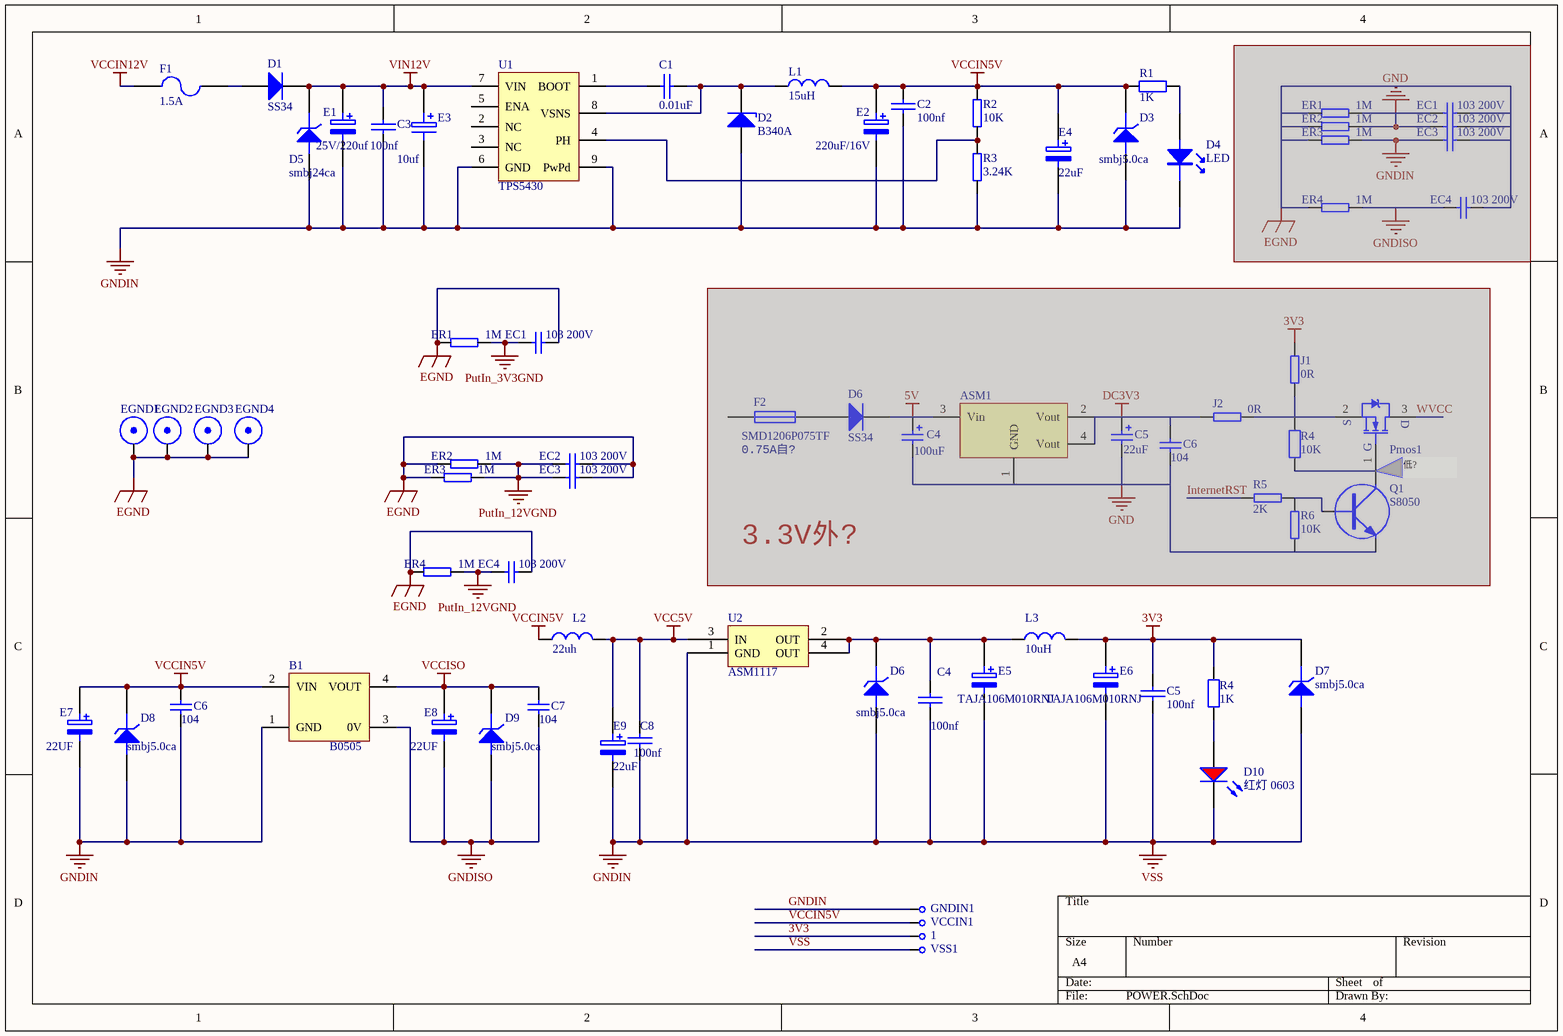
[diagram p4: POWER.SchDoc]

### Parts
(Parts that share a designator on the sheet are numbered #1, #2 ... from top to bottom, then left to right.)
1  CHECK  [CHECK-B]  (value not drawn)
ASM1  ASM1117-3.3  [LC-SOT-223]  (value not drawn)  (masked out: inside a compile mask, not in the netlist)
B1  B0505  [B0505D-1WR2]
C1  0.01uF  [LC-0603_C]
C2  100nf  [LC-0603_C]
C3  100nf  [LC-0603_C]
C4#1  100uF  [HONOR_63X54]  (masked out: inside a compile mask, not in the netlist)
C4#2  100nf  [LC-0603_C]
C5#1  22uF  [HONOR_63X54]  (masked out: inside a compile mask, not in the netlist)
C5#2  100nf  [LC-0603_C]
C6#1  104  [LC-0603_C]  (masked out: inside a compile mask, not in the netlist)
C6#2  104  [LC-0603_C]
C7  104  [LC-0603_C]
C8  100nf  [LC-0603_C]
D1  SS34  [LC-SMA(DO-214AC)_S1]
D2  value B340A  [LC-SMA(DO-214AC)_S1]  (hidden comment: Diode-Z)
D3  smbj5.0ca  [LC-SMB(DO-214AA)_S1]
D4  LED  [0603_LED_G]
D5  smbj24ca  [LC-SMB(DO-214AA)_S1]
D6#1  SS34  [LC-SMA(DO-214AC)_S5]  (masked out: inside a compile mask, not in the netlist)
D6#2  smbj5.0ca  [LC-SOD-123]
D7#1  smbj5.0ca  [LC-SOD-123]
D8  smbj5.0ca  [LC-SMB(DO-214AA)_S1]
D9  smbj5.0ca  [LC-SMB(DO-214AA)_S1]
D10  红灯 0603  [LC-0603_LED_S1]
E1  25V/220uf  [C-RB-SD8]
E2  220uF/16V  [C-RB-SD6]
E3  10uf  [LC-CASE-B_3528]
E4  22uF  [LC-CASE-B_3528]
E5  TAJA106M010RNJ  [LC-CASE-A_3216]
E6#1  TAJA106M010RNJ  [LC-CASE-A_3216]
E7  22UF  [LC-CASE-B_3528]
E8  22UF  [LC-CASE-B_3528]
E9  22uF  [LC-CASE-B_3528]
EC1#1  103 200V  [LC-1206_C]  (masked out: inside a compile mask, not in the netlist)
EC1#2  103 200V  [LC-1206_C]
EC2#1  103 200V  [LC-1206_C]  (masked out: inside a compile mask, not in the netlist)
EC2#2  103 200V  [LC-1206_C]
EC3#1  103 200V  [LC-1206_C]  (masked out: inside a compile mask, not in the netlist)
EC3#2  103 200V  [LC-1206_C]
EC4#1  103 200V  [LC-1206_C]  (masked out: inside a compile mask, not in the netlist)
EC4#2  103 200V  [LC-1206_C]
EGND1  EGND  [H-6-3.2]  (value not drawn)
EGND2  EGND  [H-6-3.2]  (value not drawn)
EGND3  EGND  [H-6-3.2]  (value not drawn)
EGND4  EGND  [H-6-3.2]  (value not drawn)
ER1#1  1M  [LC-1206_R]  (masked out: inside a compile mask, not in the netlist)
ER1#2  1M  [LC-1206_R]
ER2#1  1M  [LC-1206_R]  (masked out: inside a compile mask, not in the netlist)
ER2#2  1M  [LC-1206_R]
ER3#1  1M  [LC-1206_R]  (masked out: inside a compile mask, not in the netlist)
ER3#2  1M  [LC-1206_R]
ER4#1  1M  [LC-1206_R]  (masked out: inside a compile mask, not in the netlist)
ER4#2  1M  [LC-1206_R]
F1  value 1.5A  [1812]  (hidden comment: Fuse2)
F2#2  SMD1206P075TF  [LC-1206_R]  (masked out: inside a compile mask, not in the netlist)
GNDIN1  CHECK  [CHECK-B]  (value not drawn)
J1#1  0R  [LC-0603_L]  (masked out: inside a compile mask, not in the netlist)
J2#1  0R  [LC-0603_L]  (masked out: inside a compile mask, not in the netlist)
L1  value 15uH  [L-SMD-7]  (hidden comment: Inductor)
L2  22uh  [L-40**]
L3  value 10uH  [LC-0805_L]  (hidden comment: Inductor)
Pmos1  SI2301  [LC-SOT-23(SOT-23-3)]  (value not drawn)  (masked out: inside a compile mask, not in the netlist)
Q1#2  S8050  [LC-SOT-23(SOT-23-3)]  (masked out: inside a compile mask, not in the netlist)
R1  1K  [LC-0603_R]
R2  10K  [LC-0603_R]
R3  3.24K  [LC-0603_R]
R4#1  10K  [LC-0603_R]  (masked out: inside a compile mask, not in the netlist)
R4#2  1K  [LC-0603_R]
R5#2  2K  [LC-0603_R]  (masked out: inside a compile mask, not in the netlist)
R6#2  10K  [LC-0603_R]  (masked out: inside a compile mask, not in the netlist)
U1  TPS5430  [TPS5430]
U2  ASM1117  [SOT223]
VCCIN1  CHECK  [CHECK-B]  (value not drawn)
VSS1  CHECK  [CHECK-B]  (value not drawn)

### Nets
3V3: 1.1 C5#2.2 D7#1.2(K) E6#1.1 L3.2 R4#2.1
EGND: EC1#2.1 EC2#2.1 EC3#2.1 EC4#2.1 EGND1.0 EGND2.0 EGND3.0 EGND4.0 ER1#2.1 ER2#2.1 ER3#2.1 ER4#2.1
GNDIN: B1.1(GND) C2.1 C3.1 C4#2.1 C5#2.1 C6#2.2 C8.1 D2.1(A) D3.1(A) D4.K D5.1(A) D6#2.1(A) D7#1.1(A) D8.1(A) D10.K E1.2 E2.2 E3.2 E4.2 E5.2 E6#1.2 E7.2 E9.2 EC1#2.2 EC2#2.2 EC3#2.2 EC4#2.2 ER1#2.2 ER2#2.2 ER3#2.2 ER4#2.2 GNDIN1.1 R3.2 U1.6(GND) U1.9(PwPd) U2.1(GND) VSS1.1  [also labelled PutIn_12VGND, PutIn_3V3GND, VSS]
GNDISO: B1.3(0V) C7.2 D9.1(A) E8.2
VCC5V: C8.2 E9.1 L2.2 U2.3(IN)
VCCIN5V: B1.2(VIN) C2.2 C6#2.1 D3.2(K) D8.2(K) E2.1 E4.1 E7.1 L1.2 L2.1 R1.1 R2.2 VCCIN1.1
VCCIN12V: F1.1
VCCISO: B1.4(VOUT) C7.1 D9.2(K) E8.1
VIN12V: C3.2 D1.2(K) D5.2(K) E1.1 E3.1 U1.7(VIN)  [project net PutIn_12V]
NetC1_1: C1.1 D2.2(K) L1.1 U1.8(VSNS)
NetC1_2: C1.2 U1.1(BOOT)
NetC4#2_2: C4#2.2 D6#2.2(K) E5.1 L3.1 U2.2(OUT) U2.4(OUT)
NetD1_1: D1.1(A) F1.2
NetD4_A: D4.A R1.2
NetD10_A: D10.A R4#2.2
NetR2_1: R2.1 R3.1 U1.4(PH)

Not connected (* = marked no-connect by the designer): U1 2(NC) 3(NC) 5(ENA)

### Notes on the sheet
- (near F2#2) 0.75A自?
- 低?
- 3.3V外?

### Library data of the parts
1 = CHE: 测试点
ASM1 = VOLTREG1
C1-C3 C4#2 C5#2 C8 = CAP: Capacitor
C4#1 C5#1 = Cap Pol1: Polarized Capacitor (Radial); Published: 8-Jun-2000; Revision: July-2002: Re-released for DXP Platform.; Publisher: Altium Limited
  C4#1: Value: 100uF
  C5#1: Value: 22uF
C6#1 C6#2 C7 = Cap: Capacitor; Value: 100nF; Published: 8-Jun-2000; Revision: July-2002: Re-released for DXP Platform.; Publisher: Altium Limited
D1 = D: 二极管; Published: 8-Jun-2000; LatestRevisionDate: 17-Jul-2002; LatestRevisionNote: Re-released for DXP Platform.; PackageDocument: Sep-1996; PackageReference: SMC; Publisher: Altium Limited; Code_JEDEC: DO-214-AB
D2 = Dio: 稳压二极管; Published: 8-Jun-2000; LatestRevisionDate: 17-Jul-2002; LatestRevisionNote: Re-released for DXP Platform.; PackageReference: SMB; Publisher: Altium Limited; Code_JEDEC: DO-214-AA
D3 D5 D6#2 D7#1 D8 D9 = ZENER3: Zener Diode
D6#1 = Diode: Default Diode; Published: 8-Jun-2000; LatestRevisionDate: 17-Jul-2002; LatestRevisionNote: Re-released for DXP Platform.; PackageDocument: Sep-1996; PackageReference: SMC; Publisher: Altium Limited; Code_JEDEC: DO-214-AB
D10 = 0603 红灯: 发光二极管; ComponentLink1Des: 供应商链接; ComponentLink1URL: http://www.szlcsc.com/product/details_2659.html; Package: 0603; Supplier: LC; SuppliersPartNumber: C2286
E1 E2 E4 E5 E6#1 E7-E9 = ELECTRO2: Electrolytic Capacitor
E3 = ELECTRO1: Electrolytic Capacitor
EC1#1 EC1#2 EC2#1 EC2#2 EC3#1 EC3#2 EC4#1 EC4#2 = Cap: Capacitor; Value: 103; Published: 8-Jun-2000; Revision: July-2002: Re-released for DXP Platform.; Publisher: Altium Limited
ER1#1 ER1#2 ER2#1 ER2#2 ER3#1 ER3#2 ER4#1 ER4#2 R2 R3 = RES2
F1 = Fuse2: 可恢复保险丝; Published: 8-Jun-2000; LatestRevisionDate: 17-Jul-2002; LatestRevisionNote: Re-released for DXP Platform.; PackageReference: PIN-W2/E2.8; Publisher: Altium Limited
F2#2 = Fuse 1: Fuse; Published: 8-Jun-2000; LatestRevisionDate: 17-Jul-2002; LatestRevisionNote: Re-released for DXP Platform.; PackageReference: PIN-W2/E2.8; Publisher: Altium Limited
GNDIN1 VCCIN1 VSS1 = C: 测试点
J1#1 J2#1 R5#2 R6#2 = RES
L1 L3 = Ind: 电感; Code_IEC: 1005; Published: 8-Jun-2000; LatestRevisionDate: 17-Jul-2002; LatestRevisionNote: Re-released for DXP Platform.; PackageReference: 0402-A; Publisher: Altium Limited; Code_JEITA: 0402
L2 = Ind: 电感; Code_IEC: 1005; Value: 10uH; Published: 8-Jun-2000; LatestRevisionDate: 17-Jul-2002; LatestRevisionNote: Re-released for DXP Platform.; PackageReference: 0402-A; Publisher: Altium Limited; Code_JEITA: 0402
Pmos1 = N-MOS
Q1#2 = NPN
R1 R4#1 R4#2 = Res2: Resistor; Published: 8-Jun-2000; LatestRevisionDate: 17-Jul-2002; LatestRevisionNote: Re-released for DXP Platform.; PackageReference: AXIAL-0.4; Publisher: Altium Limited
  R1 R4#2: Value: 1K
  R4#1: Value: 10K
U2 = ASM1: 3.3V稳压芯片

## Sheet STM32F103最小系统板.SchDoc
size A3
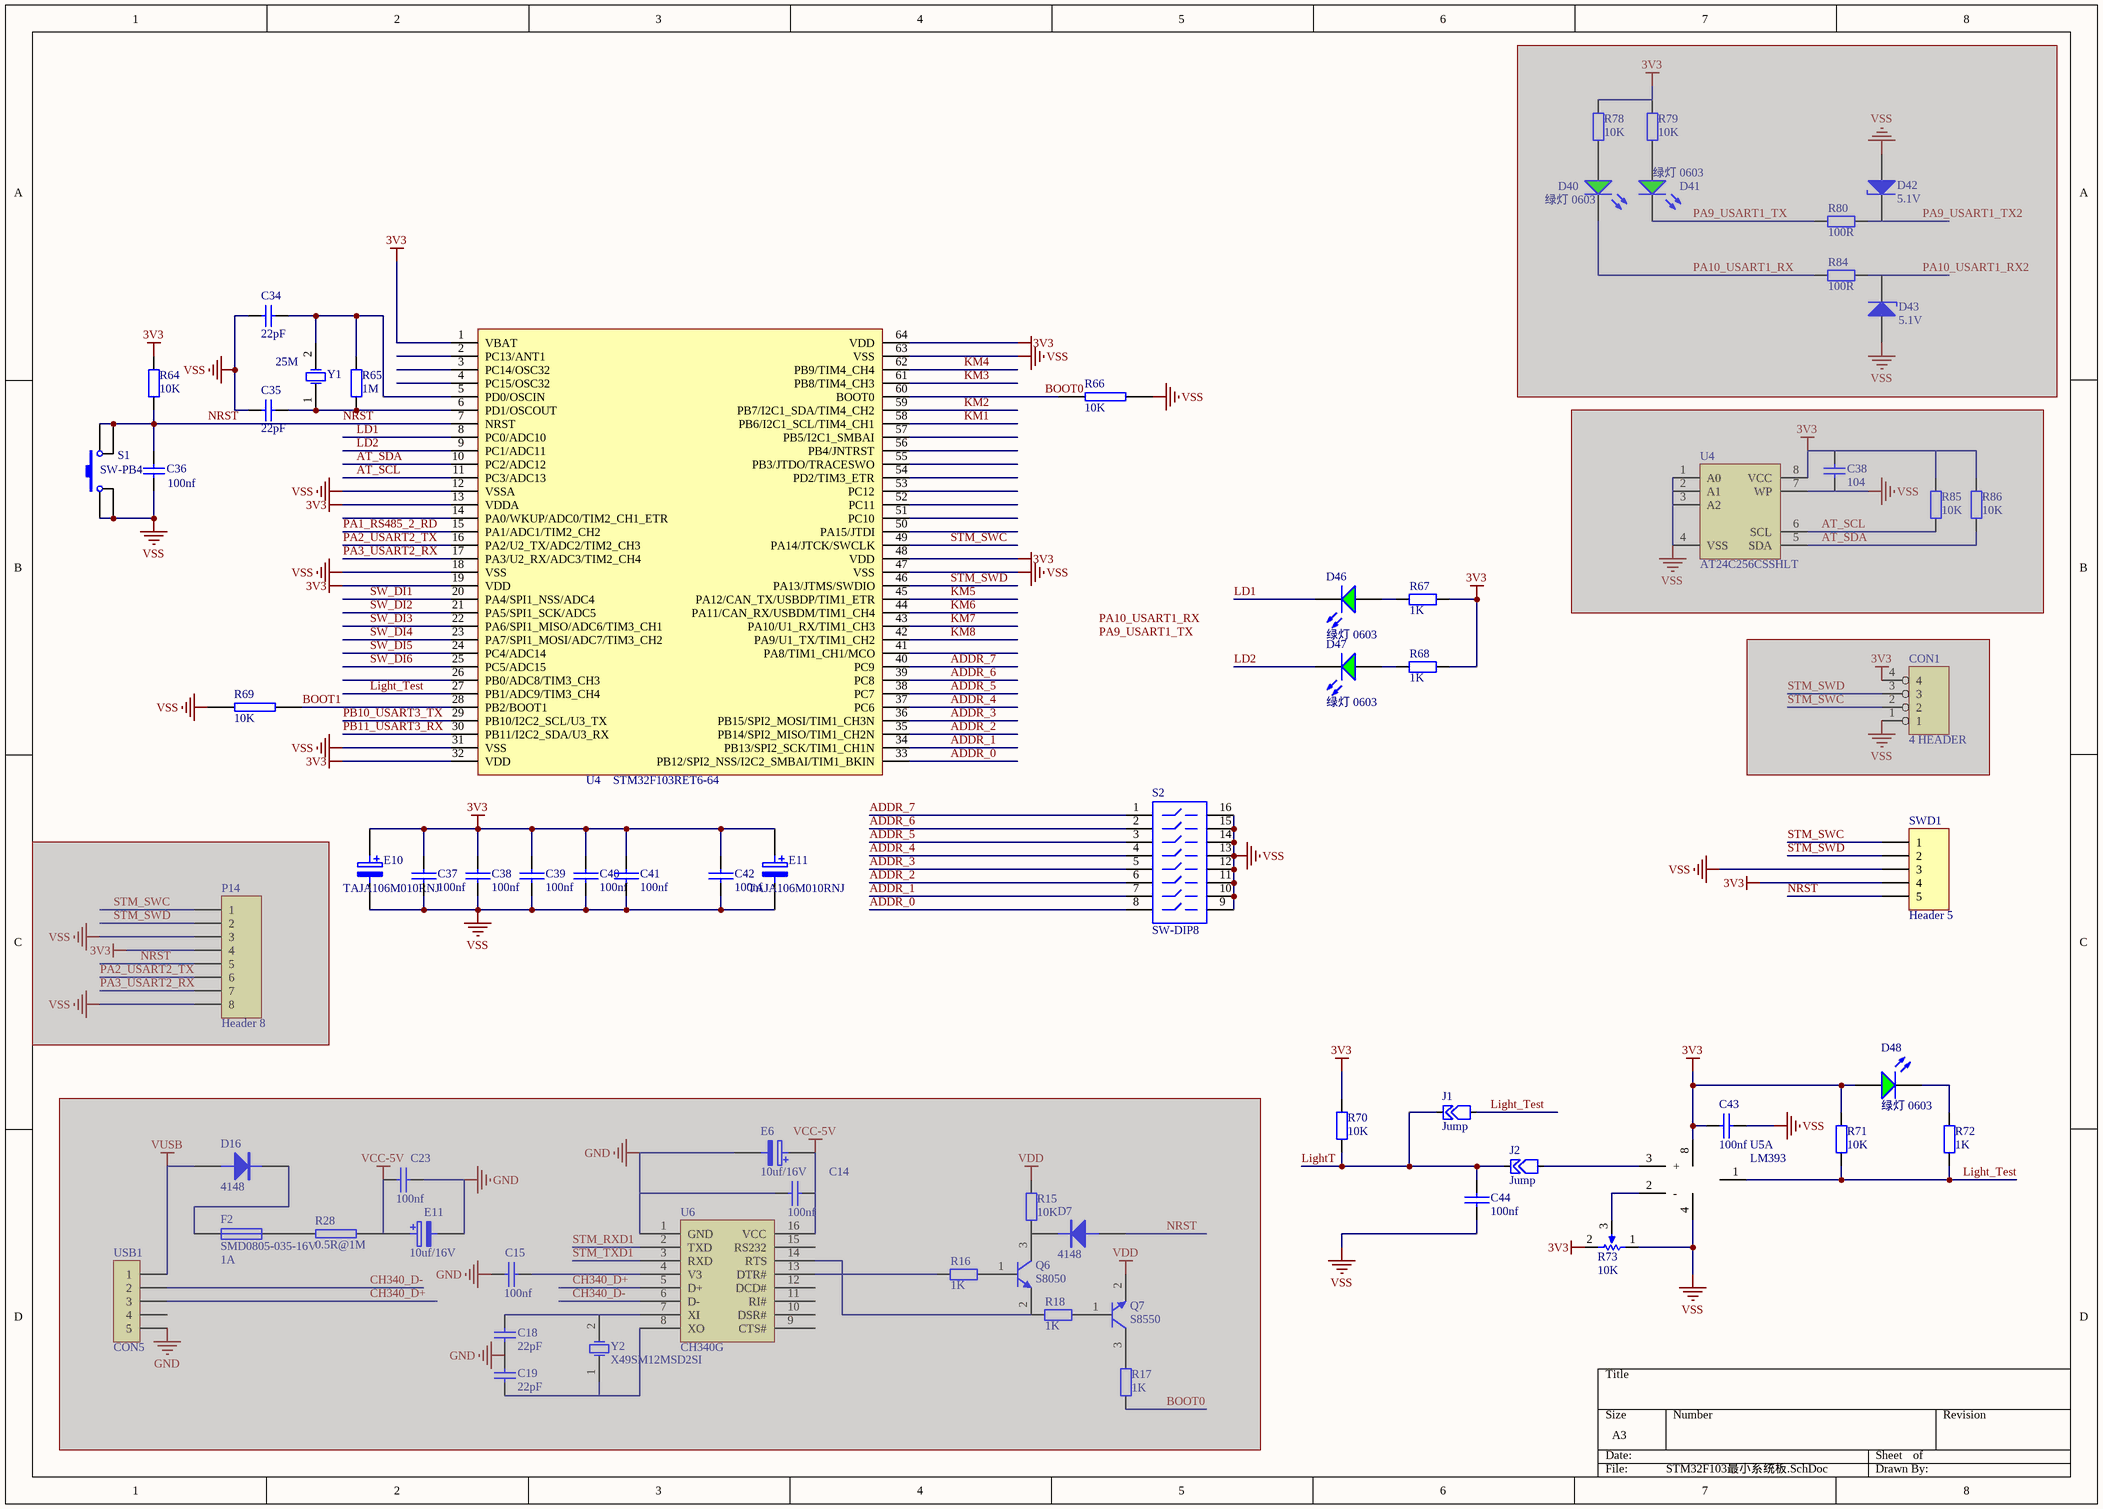
[diagram p5: STM32F103最小系统板.SchDoc]

### Parts
(Parts that share a designator on the sheet are numbered #1, #2 ... from top to bottom, then left to right.)
C14#2  100nf  [LC-0603_C]  (masked out: inside a compile mask, not in the netlist)
C15#2  100nf  [LC-0603_C]  (masked out: inside a compile mask, not in the netlist)
C18#2  22pF  [LC-0603_C]  (masked out: inside a compile mask, not in the netlist)
C19#2  22pF  [LC-0603_C]  (masked out: inside a compile mask, not in the netlist)
C23#2  100nf  [LC-0603_C]  (masked out: inside a compile mask, not in the netlist)
C34#2  22pF  [LC-0603_C]
C35  22pF  [LC-0603_C]
C36  100nf  [LC-0603_C]
C37  100nf  [LC-0603_C]
C38#1  104  [LC-0603_C]  (masked out: inside a compile mask, not in the netlist)
C38#2  100nf  [LC-0603_C]
C39  100nf  [LC-0603_C]
C40  100nf  [LC-0603_C]
C41  100nf  [LC-0603_C]
C42  100nf  [LC-0603_C]
C43  100nf  [LC-0603_C]
C44  100nf  [LC-0603_C]
CON1  4 HEADER  [sip4]  (masked out: inside a compile mask, not in the netlist)
D7#2  4148  [LC-LL-34]  (masked out: inside a compile mask, not in the netlist)
D16#2  4148  [LC-LL-34]  (masked out: inside a compile mask, not in the netlist)
D40#2  绿灯 0603  [0603_LED_G]  (masked out: inside a compile mask, not in the netlist)
D41#2  绿灯 0603  [0603_LED_G]  (masked out: inside a compile mask, not in the netlist)
D42#2  value 5.1V  [D-1206]  (hidden comment: Diode-Z)  (masked out: inside a compile mask, not in the netlist)
D43#2  value 5.1V  [D-1206]  (hidden comment: Diode-Z)  (masked out: inside a compile mask, not in the netlist)
D46  绿灯 0603  [LC-0603_LED_S1]
D47  绿灯 0603  [LC-0603_LED_S1]
D48  绿灯 0603  [0603_LED_G]
E6#2  10uf/16V  [LC-CASE-A_3216]  (masked out: inside a compile mask, not in the netlist)
E10  TAJA106M010RNJ  [LC-CASE-A_3216]
E11#1  TAJA106M010RNJ  [LC-CASE-A_3216]
E11#2  10uf/16V  [LC-CASE-A_3216]  (masked out: inside a compile mask, not in the netlist)
F2#3  SMD0805-035-16V  value 1A  [LC-0805_R]  (masked out: inside a compile mask, not in the netlist)
J1#2  Jump  [JT]
J2#2  Jump  [JT]
P14  Header 8  [HDR1X8]  (masked out: inside a compile mask, not in the netlist)
Q6#2  S8050  [LC-SOT-23(SOT-23-3)]  (masked out: inside a compile mask, not in the netlist)
Q7#2  S8550  [LC-SOT-23(SOT-23-3)]  (masked out: inside a compile mask, not in the netlist)
R15#2  10K  [LC-0603_R]  (masked out: inside a compile mask, not in the netlist)
R16#2  1K  [LC-0603_R]  (masked out: inside a compile mask, not in the netlist)
R17#2  1K  [LC-0603_R]  (masked out: inside a compile mask, not in the netlist)
R18#2  1K  [LC-0603_R]  (masked out: inside a compile mask, not in the netlist)
R28#2  0.5R@1M  [LC-0805_R]  (masked out: inside a compile mask, not in the netlist)
R64#2  10K  [LC-0603_R]
R65#2  1M  [LC-0603_R]
R66#2  10K  [LC-0603_R]
R67#2  1K  [LC-0603_R]
R68#2  1K  [LC-0603_R]
R69#2  10K  [LC-0603_R]
R70#2  value 10K  [LC-0603_R]  (hidden comment: 1K)
R71#2  value 10K  [LC-0603_R]  (hidden comment: 1K)
R72  1K  [LC-0603_R]
R73  10K  [3296W]
R78  10K  [LC-0603_R]  (masked out: inside a compile mask, not in the netlist)
R79  10K  [LC-0603_R]  (masked out: inside a compile mask, not in the netlist)
R80  value 100R  [LC-0603_R]  (hidden comment: 1K)  (masked out: inside a compile mask, not in the netlist)
R84  value 100R  [LC-0603_R]  (hidden comment: 1K)  (masked out: inside a compile mask, not in the netlist)
R85  10K  [LC-0603_R]  (masked out: inside a compile mask, not in the netlist)
R86  10K  [LC-0603_R]  (masked out: inside a compile mask, not in the netlist)
S1  SW-PB4  [sw-4]
S2  SW-DIP8  [SW-DIP8]
SWD1  Header 5  [SWD_5]
U4#1  STM32F103RET6-64  [LC-LQFP-64_10x10x05P]
U4#2  AT24C256CSSHLT  [SOIC-8]  (masked out: inside a compile mask, not in the netlist)
U5  LM393  [sop-8]  (part A of 2)
U6  CH340G  [LC-SOIC-16_150mil]
USB1  CON5  [USB_MICRO]  (masked out: inside a compile mask, not in the netlist)
Y1  25M  [LC-SMD-5032_2P]
Y2  X49SM12MSD2SI  [LC-HC-49SMD]  (masked out: inside a compile mask, not in the netlist)

### Nets
3V3: C37.2 C38#2.2 C39.2 C40.2 C41.2 C42.2 C43.2 D48.A E10.1 E11#1.1 R64#2.2 R67#2.1 R68#2.1 R70#2.1 R71#2.1 R73.2(BOT) SWD1.4 U4#1.1(VBAT) U4#1.13(VDDA) U4#1.19(VDD) U4#1.32(VDD) U4#1.48(VDD) U4#1.64(VDD) U5.8(VCC)
VSS: C34#2.1 C35.1 C36.1 C37.1 C38#2.1 C39.1 C40.1 C41.1 C42.1 C43.1 C44.1 E10.2 E11#1.2 R66#2.1 R69#2.1 R73.1(TOP) S1.1 S1.4 S2.9 S2.10 S2.11 S2.12 S2.13 S2.14 S2.15 S2.16 SWD1.3 U4#1.12(VSSA) U4#1.18(VSS) U4#1.31(VSS) U4#1.47(VSS) U4#1.63(VSS) U5.4(GND)  [project net GNDIN]
ADDR_0: S2.8 U4#1.33(PB12/SPI2_NSS/I2C2_SMBAI/TIM1_BKIN)
ADDR_1: S2.7 U4#1.34(PB13/SPI2_SCK/TIM1_CH1N)
ADDR_2: S2.6 U4#1.35(PB14/SPI2_MISO/TIM1_CH2N)
ADDR_3: S2.5 U4#1.36(PB15/SPI2_MOSI/TIM1_CH3N)
ADDR_4: S2.4 U4#1.37(PC6)
ADDR_5: S2.3 U4#1.38(PC7)
ADDR_6: S2.2 U4#1.39(PC8)
ADDR_7: S2.1 U4#1.40(PC9)
AT_SCL: U4#1.11(PC3/ADC13)
AT_SDA: U4#1.10(PC2/ADC12)
BOOT0: R66#2.2 U4#1.60(BOOT0)
BOOT1: R69#2.2 U4#1.28(PB2/BOOT1)
KM1: U4#1.58(PB6/I2C1_SCL/TIM4_CH1)
KM2: U4#1.59(PB7/I2C1_SDA/TIM4_CH2)
KM3: U4#1.61(PB8/TIM4_CH3)
KM4: U4#1.62(PB9/TIM4_CH4)
KM5: U4#1.45(PA12/CAN_TX/USBDP/TIM1_ETR)
KM6: U4#1.44(PA11/CAN_RX/USBDM/TIM1_CH4)
KM7: U4#1.43(PA10/U1_RX/TIM1_CH3)
KM8: U4#1.42(PA9/U1_TX/TIM1_CH2)
LD1: D46.K U4#1.8(PC0/ADC10)
LD2: D47.K U4#1.9(PC1/ADC11)
Light_Test: J1#2.2(GND) R71#2.2 R72.2 U4#1.27(PB1/ADC9/TIM3_CH4) U5.1(out)
LightT: C44.2 J1#2.1(GND) J2#2.1(GND) R70#2.2
NRST: C36.2 R64#2.1 S1.2 S1.3 SWD1.5 U4#1.7(NRST)
PA1_RS485_2_RD: U4#1.15(PA1/ADC1/TIM2_CH2)
PA2_USART2_TX: U4#1.16(PA2/U2_TX/ADC2/TIM2_CH3)
PA3_USART2_RX: U4#1.17(PA3/U2_RX/ADC3/TIM2_CH4)
PB10_USART3_TX: U4#1.29(PB10/I2C2_SCL/U3_TX)
PB11_USART3_RX: U4#1.30(PB11/I2C2_SDA/U3_RX)
STM_SWC: SWD1.1 U4#1.49(PA14/JTCK/SWCLK)
STM_SWD: SWD1.2 U4#1.46(PA13/JTMS/SWDIO)
SW_DI1: U4#1.20(PA4/SPI1_NSS/ADC4)
SW_DI2: U4#1.21(PA5/SPI1_SCK/ADC5)
SW_DI3: U4#1.22(PA6/SPI1_MISO/ADC6/TIM3_CH1)
SW_DI4: U4#1.23(PA7/SPI1_MOSI/ADC7/TIM3_CH2)
SW_DI5: U4#1.24(PC4/ADC14)
SW_DI6: U4#1.25(PC5/ADC15)
NetC34#2_2: C34#2.2 R65#2.2 U4#1.5(PD0/OSCIN) Y1.2(OSC2)
NetC35_2: C35.2 R65#2.1 U4#1.6(PD1/OSCOUT) Y1.1(OSC1)
NetD46_A: D46.A R67#2.2
NetD47_A: D47.A R68#2.2
NetD48_K: D48.K R72.1
NetJ2#2_2: J2#2.2(GND) U5.3(+)
NetR73_3: R73.3(TAP) U5.2(-)

Not connected (* = marked no-connect by the designer): U4#1 2(PC13/ANT1) 3(PC14/OSC32) 4(PC15/OSC32) 14(PA0/WKUP/ADC0/TIM2_CH1_ETR) 26(PB0/ADC8/TIM3_CH3) 41(PA8/TIM1_CH1/MCO) 50(PA15/JTDI) 51(PC10) 52(PC11) 53(PC12) 54(PD2/TIM3_ETR) 55(PB3/JTDO/TRACESWO) 56(PB4/JNTRST) 57(PB5/I2C1_SMBAI); U6 1(GND) 2(TXD) 3(RXD) 4(V3) 5(D+) 6(D-) 7(XI) 8(XO) 9(CTS#) 10(DSR#) 11(RI#) 12(DCD#) 13(DTR#) 14(RTS) 15(RS232) 16(VCC)

### Notes on the sheet
- Labels drawn without touching a wire or pin: PA9_USART1_TX, PA10_USART1_RX

### Library data of the parts
C14#2 C15#2 C23#2 C37 C38#2 C39-C44 = CAP: Capacitor
C18#2 C19#2 C34#2 C35 = Cap: Capacitor; Published: 8-Jun-2000; LatestRevisionDate: 17-Jul-2002; LatestRevisionNote: Re-released for DXP Platform.; PackageReference: RAD-0.3; Publisher: Altium Limited; Value: 22pF
C36 = Cap: Capacitor; Value: 0.1uF; Published: 8-Jun-2000; LatestRevisionDate: 17-Jul-2002; LatestRevisionNote: Re-released for DXP Platform.; PackageReference: RAD-0.3; Publisher: Altium Limited
C38#1 = CAP: Capacitor; Value: 100nF; Published: 8-Jun-2000; Revision: July-2002: Re-released for DXP Platform.; Publisher: Altium Limited
CON1 = 4 HEADER: 4 Pin Header
D7#2 D16#2 = DIODE
D40#2 D41#2 D46-D48 = 0: 发光二极管; ComponentLink1Description: 供应商链接; ComponentLink1URL: http://www.szlcsc.com/product/details_73152.html; Package: 0603; Supplier: LC; SuppliersPartNumber: C72043
D42#2 D43#2 = Diode-Z: 稳压二极管; Published: 8-Jun-2000; LatestRevisionDate: 17-Jul-2002; LatestRevisionNote: Re-released for DXP Platform.; PackageReference: SMB; Publisher: Altium Limited; Code_JEDEC: DO-214-AA
E6#2 E10 E11#1 E11#2 = ELECTRO2: Electrolytic Capacitor
F2#3 = F: 保险丝
P14 = Header 8: Header, 8-Pin; LatestRevisionDate: 17-Jul-2002; LatestRevisionNote: Re-released for DXP Platform.; Publisher: Altium Limited
Q7#2 = S8050
R15#2 R64#2 R78 R79 R85 R86 = Res2: Resistor; Published: 8-Jun-2000; LatestRevisionDate: 17-Jul-2002; LatestRevisionNote: Re-released for DXP Platform.; PackageReference: AXIAL-0.4; Publisher: Altium Limited; Value: 10K
R16#2 R17#2 R18#2 R65#2 = Res2: Resistor; Value: 10K; Published: 8-Jun-2000; LatestRevisionDate: 17-Jul-2002; LatestRevisionNote: Re-released for DXP Platform.; PackageReference: AXIAL-0.4; Publisher: Altium Limited
R28#2 R66#2 R69#2 = RES2
R67#2 R68#2 R70#2 R71#2 R72 R80 R84 = R: 贴片电阻; Published: 8-Jun-2000; LatestRevisionDate: 17-Jul-2002; LatestRevisionNote: Re-released for DXP Platform.; PackageReference: AXIAL-0.4; Publisher: Altium Limited
  R67#2 R68#2 R72: Value: 1K
R73 = RPot: Potentiometer; Sim Note: Enter the Resistance value and the set point into parameter fields.; Set Position: 0.5; Published: 8-Jun-2000; LatestRevisionDate: 17-Jul-2002; LatestRevisionNote: Re-released for DXP Platform.; PackageReference: VR5; Publisher: Altium Limited; PackageDescription: Variable Resistor, Thru-Hole; 3 Leads; Value: 10K
S1 = SW-: 微动开关; Published: 24-Mar-1999; LatestRevisionDate: 17-Jul-2002; LatestRevisionNote: Re-released for DXP Platform.; PackageReference: SPST-2; Publisher: Altium Limited
S2 = SW-DIP8: 4009 Series DIP Switch, Raised actuator; Published: 24-Mar-1999; LatestRevisionDate: 17-Dec-2003; LatestRevisionNote: PCB Footprint replaced.; PackageReference: DIP-16-KEY; Publisher: Altium Limited; PackageDescription: DIP; 16 Leads; Row Spacing 7.62 mm; Pitch 2.54 mm; ComponentLink1Description: Manufacturer Link; ComponentLink1URL: http://www.oupiin.com/prodindx.html#Headers
SWD1 = Header 5: Header, 5-Pin; LatestRevisionDate: 17-Jul-2002; LatestRevisionNote: Re-released for DXP Platform.; Publisher: Altium Limited
U4#1 = STM32F103RBT6
U4#2 = AT24C02: EEROM存储器
USB1 = CON5: Connector
Y1 Y2 = XTAL: Crystal Oscillator; Published: 8-Jun-2000; LatestRevisionDate: 17-Jul-2002; LatestRevisionNote: Re-released for DXP Platform.; PackageReference: R38; Publisher: Altium Limited

## Nets that join several sheets
3V3: SIX-INPORT (8 pins), RS485 (ADuM1.1 C10.2 N1.1), POWER (6 pins), STM32F103最小系统板 (24 pins)
GNDIN: SIX-INPORT (20 pins), RS485 (ADuM1.4 C10.1), SIX_OUTPORT-V2 (12 pins), POWER (37 pins), STM32F103最小系统板 (33 pins)
GNDISO: RS485 (7 pins), POWER (B1.3 C7.2 D9.1 E8.2)
PutIn_12V: SIX-INPORT (F4.1), POWER (6 pins)
VCCIN5V: SIX-INPORT (P1.18), SIX_OUTPORT-V2 (C32#2.2 F9#2.1), POWER (13 pins)
VCCIN12V: SIX-INPORT (P1.20), POWER (F1.1)
VCCISO: RS485 (7 pins), POWER (B1.4 C7.1 D9.2 E8.1)
KM1: SIX_OUTPORT-V2 (R41#3.2 R42#3.1), STM32F103最小系统板 (U4#1.58)
KM2: SIX_OUTPORT-V2 (R44#3.2 R45#3.1), STM32F103最小系统板 (U4#1.59)
KM3: SIX_OUTPORT-V2 (R46#3.2 R47#3.1), STM32F103最小系统板 (U4#1.61)
KM4: SIX_OUTPORT-V2 (R49#3.2 R50#3.1), STM32F103最小系统板 (U4#1.62)
KM5: SIX_OUTPORT-V2 (R52#3.2 R53#3.1), STM32F103最小系统板 (U4#1.45)
KM6: SIX_OUTPORT-V2 (R54#2.2 R55#2.1), STM32F103最小系统板 (U4#1.44)
KM7: SIX_OUTPORT-V2 (R57#2.2 R58#2.1), STM32F103最小系统板 (U4#1.43)
KM8: SIX_OUTPORT-V2 (R59#2.2 R61#2.1), STM32F103最小系统板 (U4#1.42)
LightT: SIX-INPORT (P1.2), STM32F103最小系统板 (C44.2 J1#2.1 J2#2.1 R70#2.2)
PA1_RS485_2_RD: RS485 (R8.1), STM32F103最小系统板 (U4#1.15)
PA2_USART2_TX: RS485 (ADuM1.3), STM32F103最小系统板 (U4#1.16)
PA3_USART2_RX: RS485 (ADuM1.2), STM32F103最小系统板 (U4#1.17)
RS458_A: SIX-INPORT (P1.16), RS485 (F3.2)
RS485_B: SIX-INPORT (P1.15), RS485 (F2#1.2)
SW_DI1: SIX-INPORT (C16.1 PHC1.4 R14.1), STM32F103最小系统板 (U4#1.20)
SW_DI2: SIX-INPORT (C18#1.1 PHC2.4 R20.1), STM32F103最小系统板 (U4#1.21)
SW_DI3: SIX-INPORT (C25.1 PHC3.4 R27.1), STM32F103最小系统板 (U4#1.22)
SW_DI4: SIX-INPORT (C30#1.1 PHC4.4 R34.1), STM32F103最小系统板 (U4#1.23)